# Altium project FPV0-3.PrjPCB
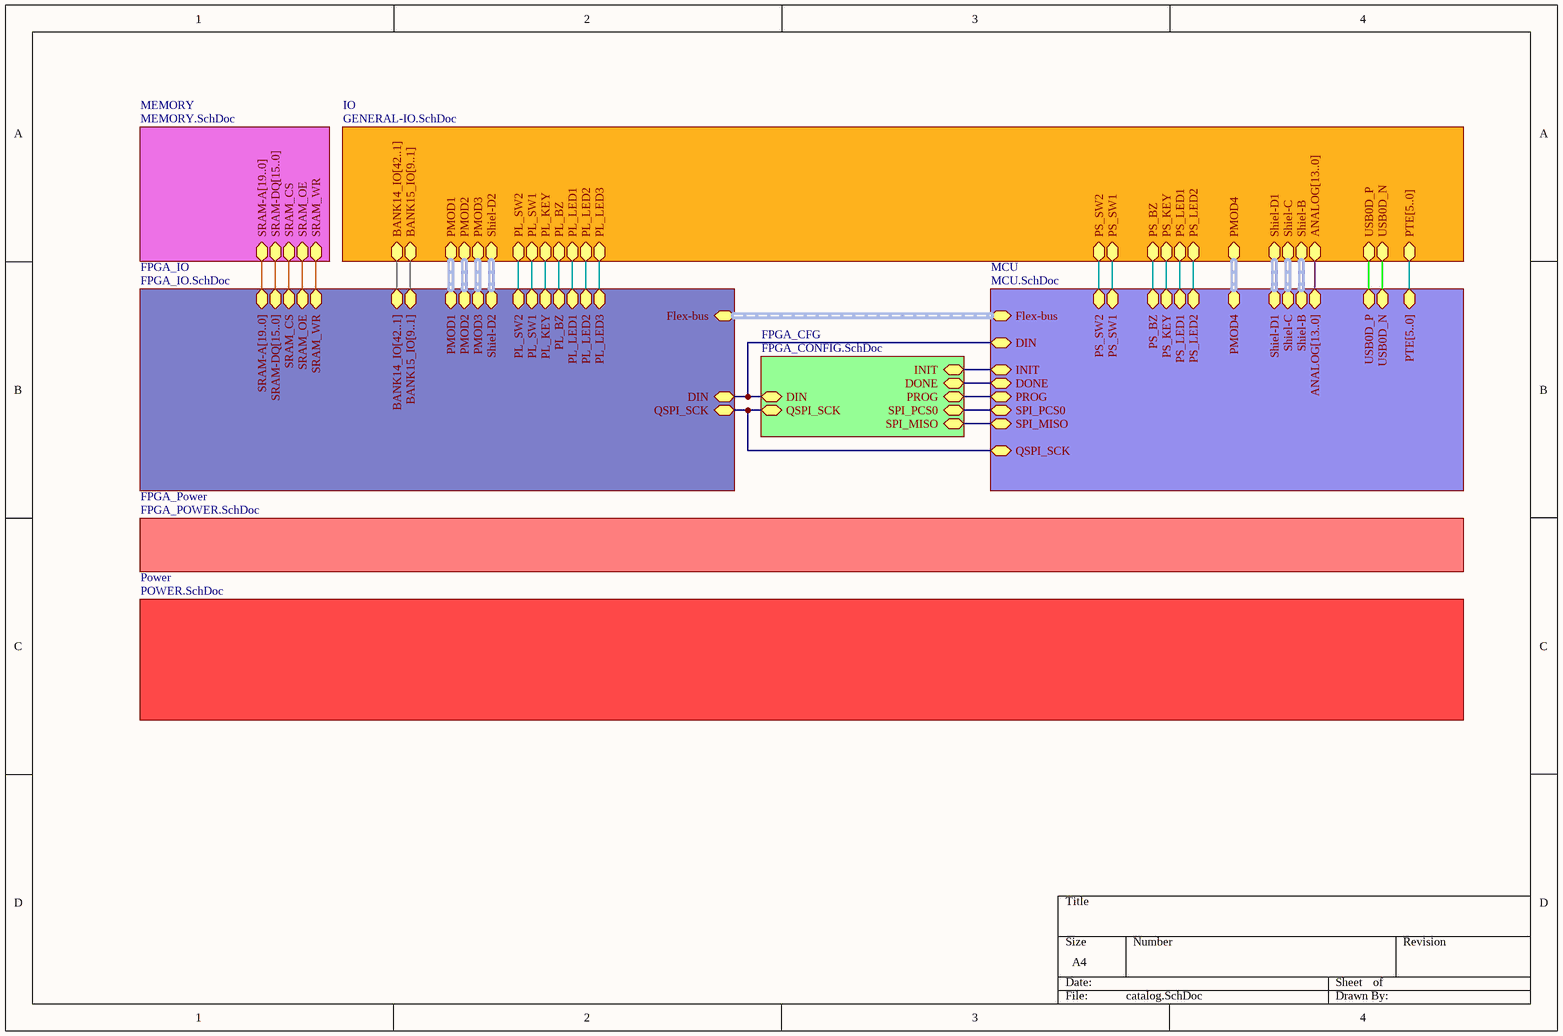
[diagram p0: catalog.SchDoc]
7 sheets, 160 parts. Net scope: hierarchical (ports join the sheet entries above them; power ports are global).
Board file: FPV0-3.PcbDoc
Sheets:
  catalog.SchDoc
    FPGA_IO = FPGA_IO.SchDoc
    Power = POWER.SchDoc
    IO = GENERAL-IO.SchDoc
    MEMORY = MEMORY.SchDoc
    FPGA_CFG = FPGA_CONFIG.SchDoc
    FPGA_Power = FPGA_POWER.SchDoc

## Sheet catalog.SchDoc
size A4

### Sub-sheets
FPGA_CFG = FPGA_CONFIG.SchDoc: QSPI_SCK, DIN, INIT, DONE, PROG, SPI_PCS0, SPI_MISO
FPGA_IO = FPGA_IO.SchDoc: QSPI_SCK, BANK14_IO[42..1], BANK15_IO[9..1], DIN, Flex-bus (harness Flexbus), SRAM-A[19..0] (harness Flexbus), SRAM-DQ[15..0] (harness Flexbus), SRAM_CS, SRAM_OE, SRAM_WR, Shiel-D2 (harness ShielD2), PL_SW2, PL_SW1, PL_KEY, PL_LED1, PL_LED2, PL_LED3, PMOD1 (harness PMOD), PMOD2 (harness PMOD), PMOD3 (harness PMOD), PL_BZ
FPGA_Power = FPGA_POWER.SchDoc: no entries
IO = GENERAL-IO.SchDoc: BANK14_IO[42..1], BANK15_IO[9..1], PTE[5..0] (harness Flexbus), USB0D_P, USB0D_N, ANALOG[13..0], Shiel-B (harness ShielB), PMOD4 (harness PMOD), Shiel-C (harness ShielC), Shiel-D1 (harness ShielD1), Shiel-D2 (harness ShielD2), PS_LED2, PS_LED1, PL_SW2, PL_SW1, PL_KEY, PS_KEY, PS_SW1, PS_SW2, PL_LED1, PL_LED2, PL_LED3, PMOD1 (harness PMOD), PMOD2 (harness PMOD), PMOD3 (harness PMOD), PL_BZ, PS_BZ
MCU = MCU.SchDoc (file not in this document): Flex-bus (harness Flexbus), PTE[5..0] (harness Flexbus), USB0D_N, USB0D_P, ANALOG[13..0], Shiel-B (harness ShielB), PMOD4 (harness PMOD), Shiel-C (harness ShielC), Shiel-D1 (harness ShielD1), DIN, INIT, DONE, PROG, SPI_PCS0, SPI_MISO, QSPI_SCK, PS_LED2, PS_LED1, PS_KEY, PS_SW1, PS_SW2, PS_BZ
MEMORY = MEMORY.SchDoc: SRAM-A[19..0] (harness Flexbus), SRAM-DQ[15..0] (harness Flexbus), SRAM_CS, SRAM_OE, SRAM_WR
Power = POWER.SchDoc: no entries

### Nets
BANK14_IO1: sheet FPGA_IO/PL_KEY, sheet IO/PL_KEY
BANK14_IO2: sheet FPGA_IO/PL_LED3, sheet IO/PL_LED3
BANK14_IO4: sheet FPGA_IO/PL_LED1, sheet IO/PL_LED1
BANK14_IO5: sheet FPGA_IO/PL_LED2, sheet IO/PL_LED2
BANK14_IO6: sheet FPGA_IO/PL_BZ, sheet IO/PL_BZ
BANK34_IO13: sheet FPGA_IO/PL_SW1, sheet IO/PL_SW1
BANK34_IO20: sheet FPGA_IO/PL_SW2, sheet IO/PL_SW2
DIN: sheet FPGA_IO/DIN, sheet FPGA_CFG/DIN, sheet MCU/DIN
DONE: sheet FPGA_CFG/DONE, sheet MCU/DONE
INIT: sheet FPGA_CFG/INIT, sheet MCU/INIT
PROG: sheet FPGA_CFG/PROG, sheet MCU/PROG
PTA6: sheet IO/PS_SW1, sheet MCU/PS_SW1
PTA7: sheet IO/PS_SW2, sheet MCU/PS_SW2
PTD8: sheet IO/PS_LED1, sheet MCU/PS_LED1
PTD9: sheet IO/PS_LED2, sheet MCU/PS_LED2
PTE26: sheet IO/PS_BZ, sheet MCU/PS_BZ
PTE27: sheet IO/PS_KEY, sheet MCU/PS_KEY
QSPI_SCK: sheet FPGA_IO/QSPI_SCK, sheet FPGA_CFG/QSPI_SCK, sheet MCU/QSPI_SCK
SPI2_PCS0: sheet FPGA_CFG/SPI_PCS0, sheet MCU/SPI_PCS0
SPI2_SIN: sheet FPGA_CFG/SPI_MISO, sheet MCU/SPI_MISO
SRAM_CS: sheet FPGA_IO/SRAM_CS, sheet MEMORY/SRAM_CS
SRAM_OE: sheet FPGA_IO/SRAM_OE, sheet MEMORY/SRAM_OE
SRAM_WR: sheet FPGA_IO/SRAM_WR, sheet MEMORY/SRAM_WR
USB0D_N: sheet IO/USB0D_N, sheet MCU/USB0D_N
USB0D_P: sheet IO/USB0D_P, sheet MCU/USB0D_P

### Buses and harness runs
bus sheet FPGA_IO/BANK14_IO[42..1] = sheet IO/BANK14_IO[42..1]
bus sheet FPGA_IO/BANK15_IO[9..1] = sheet IO/BANK15_IO[9..1]
bus sheet IO/ANALOG[13..0] = sheet MCU/ANALOG[13..0]
harness sheet FPGA_IO/Flex-bus = sheet MCU/Flex-bus
harness sheet FPGA_IO/PMOD1 = sheet IO/PMOD1
harness sheet FPGA_IO/PMOD2 = sheet IO/PMOD2
harness sheet FPGA_IO/PMOD3 = sheet IO/PMOD3
harness sheet FPGA_IO/Shiel-D2 = sheet IO/Shiel-D2
harness sheet IO/PMOD4 = sheet MCU/PMOD4
harness sheet IO/Shiel-B = sheet MCU/Shiel-B
harness sheet IO/Shiel-C = sheet MCU/Shiel-C
harness sheet IO/Shiel-D1 = sheet MCU/Shiel-D1

## Sheet FPGA_IO.SchDoc
size A3
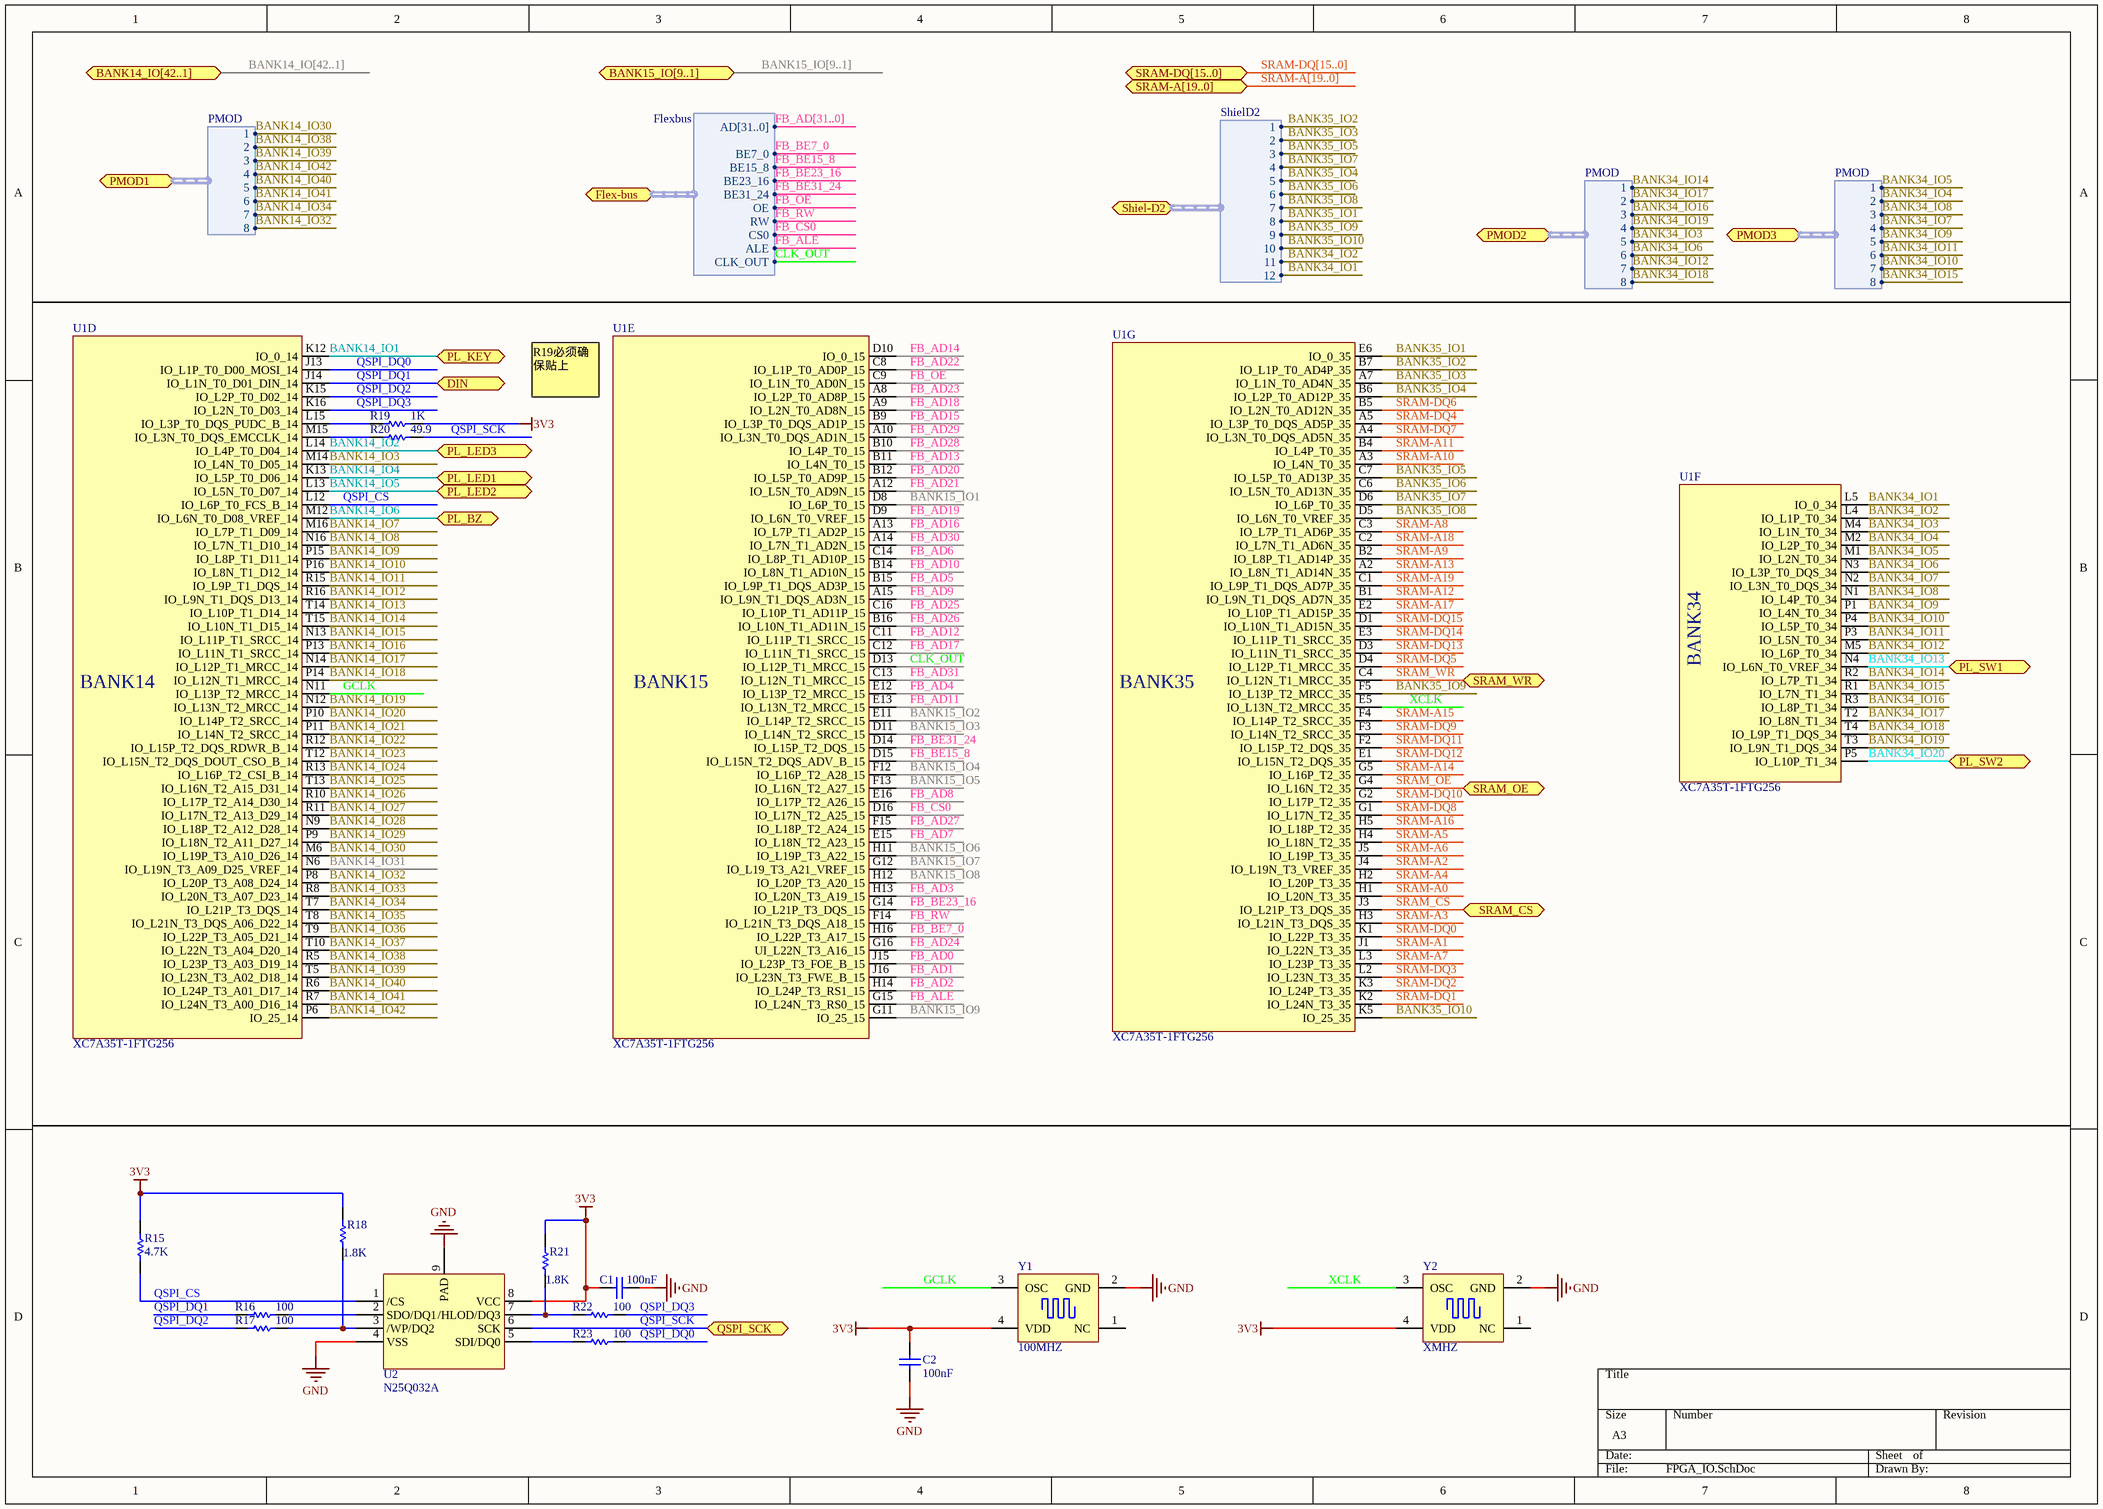
[diagram p1: FPGA_IO.SchDoc]

### Parts
C1  value 100nF  [1608[0603]]  (hidden comment: Cap)
C2  value 100nF  [1608[0603]]  (hidden comment: Cap)
R15  value 4.7K  [1608[0603]]  (hidden comment: Res)
R16  value 100  [1608[0603]]  (hidden comment: Res)
R17  value 100  [1608[0603]]  (hidden comment: Res)
R18  value 1.8K  [1608[0603]]  (hidden comment: Res)
R19  value 1K  [1608[0603]]  (hidden comment: Res)
R20  value 49.9  [R2012]  (hidden comment: Res)
R21  value 1.8K  [1608[0603]]  (hidden comment: Res)
R22  value 100  [1608[0603]]  (hidden comment: Res)
R23  value 100  [R2012]  (hidden comment: Res)
U1  XC7A35T-1FTG256  [BGA100P9X9-81A]  (parts D,E,F,G of 7)
U2  N25Q032A  [QFN127P500X600X100_HS-9N]
Y1  100MHZ  [XTAL7_3225]
Y2  XMHZ  [XTAL7_3225]

### Ports
BANK14_IO[42..1], BANK15_IO[9..1], DIN, Flex-bus (harness Flexbus), PL_BZ, PL_KEY, PL_LED1, PL_LED2, PL_LED3, PL_SW1, PL_SW2, PMOD1 (harness PMOD), PMOD2 (harness PMOD), PMOD3 (harness PMOD), QSPI_SCK, Shiel-D2 (harness ShielD2), SRAM-A[19..0], SRAM-DQ[15..0], SRAM_CS, SRAM_OE, SRAM_WR

### Harnesses
Flexbus: BE7_0, CS0, BE31_24, CLK_OUT, ALE, BE23_16, RW, BE15_8, OE, AD[31..0]
ShielD2: 1, 2, 3, 4, 5, 6, 7, 8, 9, 10, 11, 12
PMOD: 1, 2, 3, 4, 5, 6, 7, 8

### Nets
3V3: C1.1 C2.2 R15.1 R18.1 R19.1 R21.1 U2.8(VCC) Y1.4(VDD) Y2.4(VDD)
GND: C1.2 C2.1 U2.4(VSS) U2.9(PAD) Y1.2(GND) Y2.2(GND)
BANK14_IO1: U1.K12(IO_0_14) ; port PL_KEY
BANK14_IO2: U1.L14(IO_L4P_T0_D04_14) ; port PL_LED3
BANK14_IO3: U1.M14(IO_L4N_T0_D05_14)
BANK14_IO4: U1.K13(IO_L5P_T0_D06_14) ; port PL_LED1
BANK14_IO5: U1.L13(IO_L5N_T0_D07_14) ; port PL_LED2
BANK14_IO6: U1.M12(IO_L6N_T0_D08_VREF_14) ; port PL_BZ
BANK14_IO7: U1.M16(IO_L7P_T1_D09_14)
BANK14_IO8: U1.N16(IO_L7N_T1_D10_14)
BANK14_IO9: U1.P15(IO_L8P_T1_D11_14)
BANK14_IO10: U1.P16(IO_L8N_T1_D12_14)
BANK14_IO11: U1.R15(IO_L9P_T1_DQS_14)
BANK14_IO12: U1.R16(IO_L9N_T1_DQS_D13_14)
BANK14_IO13: U1.T14(IO_L10P_T1_D14_14)
BANK14_IO14: U1.T15(IO_L10N_T1_D15_14)
BANK14_IO15: U1.N13(IO_L11P_T1_SRCC_14)
BANK14_IO16: U1.P13(IO_L11N_T1_SRCC_14)
BANK14_IO17: U1.N14(IO_L12P_T1_MRCC_14)
BANK14_IO18: U1.P14(IO_L12N_T1_MRCC_14)
BANK14_IO19: U1.N12(IO_L13N_T2_MRCC_14)
BANK14_IO20: U1.P10(IO_L14P_T2_SRCC_14)
BANK14_IO21: U1.P11(IO_L14N_T2_SRCC_14)
BANK14_IO22: U1.R12(IO_L15P_T2_DQS_RDWR_B_14)
BANK14_IO23: U1.T12(IO_L15N_T2_DQS_DOUT_CSO_B_14)
BANK14_IO24: U1.R13(IO_L16P_T2_CSI_B_14)
BANK14_IO25: U1.T13(IO_L16N_T2_A15_D31_14)
BANK14_IO26: U1.R10(IO_L17P_T2_A14_D30_14)
BANK14_IO27: U1.R11(IO_L17N_T2_A13_D29_14)
BANK14_IO28: U1.N9(IO_L18P_T2_A12_D28_14)
BANK14_IO29: U1.P9(IO_L18N_T2_A11_D27_14)
BANK14_IO30: U1.M6(IO_L19P_T3_A10_D26_14) ; port PMOD1.1
BANK14_IO31: U1.N6(IO_L19N_T3_A09_D25_VREF_14)
BANK14_IO32: U1.P8(IO_L20P_T3_A08_D24_14) ; port PMOD1.8
BANK14_IO33: U1.R8(IO_L20N_T3_A07_D23_14)
BANK14_IO34: U1.T7(IO_L21P_T3_DQS_14) ; port PMOD1.7
BANK14_IO35: U1.T8(IO_L21N_T3_DQS_A06_D22_14)
BANK14_IO36: U1.T9(IO_L22P_T3_A05_D21_14)
BANK14_IO37: U1.T10(IO_L22N_T3_A04_D20_14)
BANK14_IO38: U1.R5(IO_L23P_T3_A03_D19_14) ; port PMOD1.2
BANK14_IO39: U1.T5(IO_L23N_T3_A02_D18_14) ; port PMOD1.3
BANK14_IO40: U1.R6(IO_L24P_T3_A01_D17_14) ; port PMOD1.5
BANK14_IO41: U1.R7(IO_L24N_T3_A00_D16_14) ; port PMOD1.6
BANK14_IO42: U1.P6(IO_25_14) ; port PMOD1.4
BANK15_IO1: U1.D8(IO_L6P_T0_15)
BANK15_IO2: U1.E11(IO_L14P_T2_SRCC_15)
BANK15_IO3: U1.D11(IO_L14N_T2_SRCC_15)
BANK15_IO4: U1.F12(IO_L16P_T2_A28_15)
BANK15_IO5: U1.F13(IO_L16N_T2_A27_15)
BANK15_IO6: U1.H11(IO_L19P_T3_A22_15)
BANK15_IO7: U1.G12(IO_L19_T3_A21_VREF_15)
BANK15_IO8: U1.H12(IO_L20P_T3_A20_15)
BANK15_IO9: U1.G11(IO_25_15)
BANK34_IO1: U1.L5(IO_0_34) ; port Shiel-D2.12
BANK34_IO2: U1.L4(IO_L1P_T0_34) ; port Shiel-D2.11
BANK34_IO3: U1.M4(IO_L1N_T0_34) ; port PMOD2.5
BANK34_IO4: U1.M2(IO_L2P_T0_34) ; port PMOD3.2
BANK34_IO5: U1.M1(IO_L2N_T0_34) ; port PMOD3.1
BANK34_IO6: U1.N3(IO_L3P_T0_DQS_34) ; port PMOD2.6
BANK34_IO7: U1.N2(IO_L3N_T0_DQS_34) ; port PMOD3.4
BANK34_IO8: U1.N1(IO_L4P_T0_34) ; port PMOD3.3
BANK34_IO9: U1.P1(IO_L4N_T0_34) ; port PMOD3.5
BANK34_IO10: U1.P4(IO_L5P_T0_34) ; port PMOD3.7
BANK34_IO11: U1.P3(IO_L5N_T0_34) ; port PMOD3.6
BANK34_IO12: U1.M5(IO_L6P_T0_34) ; port PMOD2.7
BANK34_IO13: U1.N4(IO_L6N_T0_VREF_34) ; port PL_SW1
BANK34_IO14: U1.R2(IO_L7P_T1_34) ; port PMOD2.1
BANK34_IO15: U1.R1(IO_L7N_T1_34) ; port PMOD3.8
BANK34_IO16: U1.R3(IO_L8P_T1_34) ; port PMOD2.3
BANK34_IO17: U1.T2(IO_L8N_T1_34) ; port PMOD2.2
BANK34_IO18: U1.T4(IO_L9P_T1_DQS_34) ; port PMOD2.8
BANK34_IO19: U1.T3(IO_L9N_T1_DQS_34) ; port PMOD2.4
BANK34_IO20: U1.P5(IO_L10P_T1_34) ; port PL_SW2
BANK35_IO1: U1.E6(IO_0_35) ; port Shiel-D2.8
BANK35_IO2: U1.B7(IO_L1P_T0_AD4P_35) ; port Shiel-D2.1
BANK35_IO3: U1.A7(IO_L1N_T0_AD4N_35) ; port Shiel-D2.2
BANK35_IO4: U1.B6(IO_L2P_T0_AD12P_35) ; port Shiel-D2.5
BANK35_IO5: U1.C7(IO_L5P_T0_AD13P_35) ; port Shiel-D2.3
BANK35_IO6: U1.C6(IO_L5N_T0_AD13N_35) ; port Shiel-D2.6
BANK35_IO7: U1.D6(IO_L6P_T0_35) ; port Shiel-D2.4
BANK35_IO8: U1.D5(IO_L6N_T0_VREF_35) ; port Shiel-D2.7
BANK35_IO9: U1.F5(IO_L13P_T2_MRCC_35) ; port Shiel-D2.9
BANK35_IO10: U1.K5(IO_25_35) ; port Shiel-D2.10
CLK_OUT: U1.D13(IO_L12P_T1_MRCC_15) ; port Flex-bus.CLK_OUT
FB_AD0: U1.J15(IO_L23P_T3_FOE_B_15)
FB_AD1: U1.J16(IO_L23N_T3_FWE_B_15)
FB_AD2: U1.H14(IO_L24P_T3_RS1_15)
FB_AD3: U1.H13(IO_L20N_T3_A19_15)
FB_AD4: U1.E12(IO_L13P_T2_MRCC_15)
FB_AD5: U1.B15(IO_L9P_T1_DQS_AD3P_15)
FB_AD6: U1.C14(IO_L8P_T1_AD10P_15)
FB_AD7: U1.E15(IO_L18N_T2_A23_15)
FB_AD8: U1.E16(IO_L17P_T2_A26_15)
FB_AD9: U1.A15(IO_L9N_T1_DQS_AD3N_15)
FB_AD10: U1.B14(IO_L8N_T1_AD10N_15)
FB_AD11: U1.E13(IO_L13N_T2_MRCC_15)
FB_AD12: U1.C11(IO_L11P_T1_SRCC_15)
FB_AD13: U1.B11(IO_L4N_T0_15)
FB_AD14: U1.D10(IO_0_15)
FB_AD15: U1.B9(IO_L3P_T0_DQS_AD1P_15)
FB_AD16: U1.A13(IO_L7P_T1_AD2P_15)
FB_AD17: U1.C12(IO_L11N_T1_SRCC_15)
FB_AD18: U1.A9(IO_L2N_T0_AD8N_15)
FB_AD19: U1.D9(IO_L6N_T0_VREF_15)
FB_AD20: U1.B12(IO_L5P_T0_AD9P_15)
FB_AD21: U1.A12(IO_L5N_T0_AD9N_15)
FB_AD22: U1.C8(IO_L1P_T0_AD0P_15)
FB_AD23: U1.A8(IO_L2P_T0_AD8P_15)
FB_AD24: U1.G16(UI_L22N_T3_A16_15)
FB_AD25: U1.C16(IO_L10P_T1_AD11P_15)
FB_AD26: U1.B16(IO_L10N_T1_AD11N_15)
FB_AD27: U1.F15(IO_L18P_T2_A24_15)
FB_AD28: U1.B10(IO_L4P_T0_15)
FB_AD29: U1.A10(IO_L3N_T0_DQS_AD1N_15)
FB_AD30: U1.A14(IO_L7N_T1_AD2N_15)
FB_AD31: U1.C13(IO_L12N_T1_MRCC_15)
FB_ALE: U1.G15(IO_L24N_T3_RS0_15) ; port Flex-bus.ALE
FB_BE7_0: U1.H16(IO_L22P_T3_A17_15) ; port Flex-bus.BE7_0
FB_BE15_8: U1.D15(IO_L15N_T2_DQS_ADV_B_15) ; port Flex-bus.BE15_8
FB_BE23_16: U1.G14(IO_L21P_T3_DQS_15) ; port Flex-bus.BE23_16
FB_BE31_24: U1.D14(IO_L15P_T2_DQS_15) ; port Flex-bus.BE31_24
FB_CS0: U1.D16(IO_L17N_T2_A25_15) ; port Flex-bus.CS0
FB_OE: U1.C9(IO_L1N_T0_AD0N_15) ; port Flex-bus.OE
FB_RW: U1.F14(IO_L21N_T3_DQS_A18_15) ; port Flex-bus.RW
GCLK: U1.N11(IO_L13P_T2_MRCC_14) Y1.3(OSC)
QSPI_CS: R15.2 U1.L12(IO_L6P_T0_FCS_B_14) U2.1(/CS)
QSPI_DQ0: R23.1 U1.J13(IO_L1P_T0_D00_MOSI_14)
QSPI_DQ1: R16.2 U1.J14(IO_L1N_T0_D01_DIN_14) ; port DIN  [project net DIN]
QSPI_DQ2: R17.2 U1.K15(IO_L2P_T0_D02_14)
QSPI_DQ3: R22.1 U1.K16(IO_L2N_T0_D03_14)
QSPI_SCK: R20.1 U2.6(SCK) ; port QSPI_SCK
SRAM-A0: U1.H1(IO_L20N_T3_35)
SRAM-A1: U1.J1(IO_L22N_T3_35)
SRAM-A2: U1.J4(IO_L19N_T3_VREF_35)
SRAM-A3: U1.H3(IO_L21N_T3_DQS_35)
SRAM-A4: U1.H2(IO_L20P_T3_35)
SRAM-A5: U1.H4(IO_L18N_T2_35)
SRAM-A6: U1.J5(IO_L19P_T3_35)
SRAM-A7: U1.L3(IO_L23P_T3_35)
SRAM-A8: U1.C3(IO_L7P_T1_AD6P_35)
SRAM-A9: U1.B2(IO_L8P_T1_AD14P_35)
SRAM-A10: U1.A3(IO_L4N_T0_35)
SRAM-A11: U1.B4(IO_L4P_T0_35)
SRAM-A12: U1.B1(IO_L9N_T1_DQS_AD7N_35)
SRAM-A13: U1.A2(IO_L8N_T1_AD14N_35)
SRAM-A14: U1.G5(IO_L16P_T2_35)
SRAM-A15: U1.F4(IO_L14P_T2_SRCC_35)
SRAM-A16: U1.H5(IO_L18P_T2_35)
SRAM-A17: U1.E2(IO_L10P_T1_AD15P_35)
SRAM-A18: U1.C2(IO_L7N_T1_AD6N_35)
SRAM-A19: U1.C1(IO_L9P_T1_DQS_AD7P_35)
SRAM-DQ0: U1.K1(IO_L22P_T3_35)
SRAM-DQ1: U1.K2(IO_L24N_T3_35)
SRAM-DQ2: U1.K3(IO_L24P_T3_35)
SRAM-DQ3: U1.L2(IO_L23N_T3_35)
SRAM-DQ4: U1.A5(IO_L3P_T0_DQS_AD5P_35)
SRAM-DQ5: U1.D4(IO_L12P_T1_MRCC_35)
SRAM-DQ6: U1.B5(IO_L2N_T0_AD12N_35)
SRAM-DQ7: U1.A4(IO_L3N_T0_DQS_AD5N_35)
SRAM-DQ8: U1.G1(IO_L17N_T2_35)
SRAM-DQ9: U1.F3(IO_L14N_T2_SRCC_35)
SRAM-DQ10: U1.G2(IO_L17P_T2_35)
SRAM-DQ11: U1.F2(IO_L15P_T2_DQS_35)
SRAM-DQ12: U1.E1(IO_L15N_T2_DQS_35)
SRAM-DQ13: U1.D3(IO_L11N_T1_SRCC_35)
SRAM-DQ14: U1.E3(IO_L11P_T1_SRCC_35)
SRAM-DQ15: U1.D1(IO_L10N_T1_AD15N_35)
SRAM_CS: U1.J3(IO_L21P_T3_DQS_35) ; port SRAM_CS
SRAM_OE: U1.G4(IO_L16N_T2_35) ; port SRAM_OE
SRAM_WR: U1.C4(IO_L12N_T1_MRCC_35) ; port SRAM_WR
XCLK: U1.E5(IO_L13N_T2_MRCC_35) Y2.3(OSC)
NetR16_1: R16.1 U2.2(SDO/DQ1)
NetR17_1: R17.1 R18.2 U2.3(/WP/DQ2)
NetR19_2: R19.2 U1.L15(IO_L3P_T0_DQS_PUDC_B_14)
NetR20_2: R20.2 U1.M15(IO_L3N_T0_DQS_EMCCLK_14)
NetR21_2: R21.2 R22.2 U2.7(/HLOD/DQ3)
NetR23_2: R23.2 U2.5(SDI/DQ0)

Not connected (* = marked no-connect by the designer): Y1 1(NC); Y2 1(NC)

### Buses and harness runs
bus BANK14_IO[42..1] = port BANK14_IO[42..1]
bus BANK15_IO[9..1] = port BANK15_IO[9..1]
bus FB_AD[31..0]
bus SRAM-A[19..0] = port SRAM-A[19..0]
bus SRAM-DQ[15..0] = port SRAM-DQ[15..0]

### Notes on the sheet
- R19必须确保贴上
- (in symbol XC7A35T-1FTG256, part D) BANK14
- (in symbol XC7A35T-1FTG256, part E) BANK15
- (in symbol XC7A35T-1FTG256, part F) BANK34
- (in symbol XC7A35T-1FTG256, part G) BANK35

### Library data of the parts
C1 C2 = Cap: 贴片电容; Published: 8-Jun-2000; LatestRevisionDate: 17-Jul-2002; LatestRevisionNote: Re-released for DXP Platform.; PackageReference: RAD-0.3; Publisher: Altium Limited
R15-R23 = Res: 贴片电阻; Published: 8-Jun-2000; LatestRevisionDate: 17-Jul-2002; LatestRevisionNote: Re-released for DXP Platform.; PackageReference: AXIAL-0.3; Publisher: Altium Limited
Y1 Y2 = XTAL1

## Sheet POWER.SchDoc
size A4
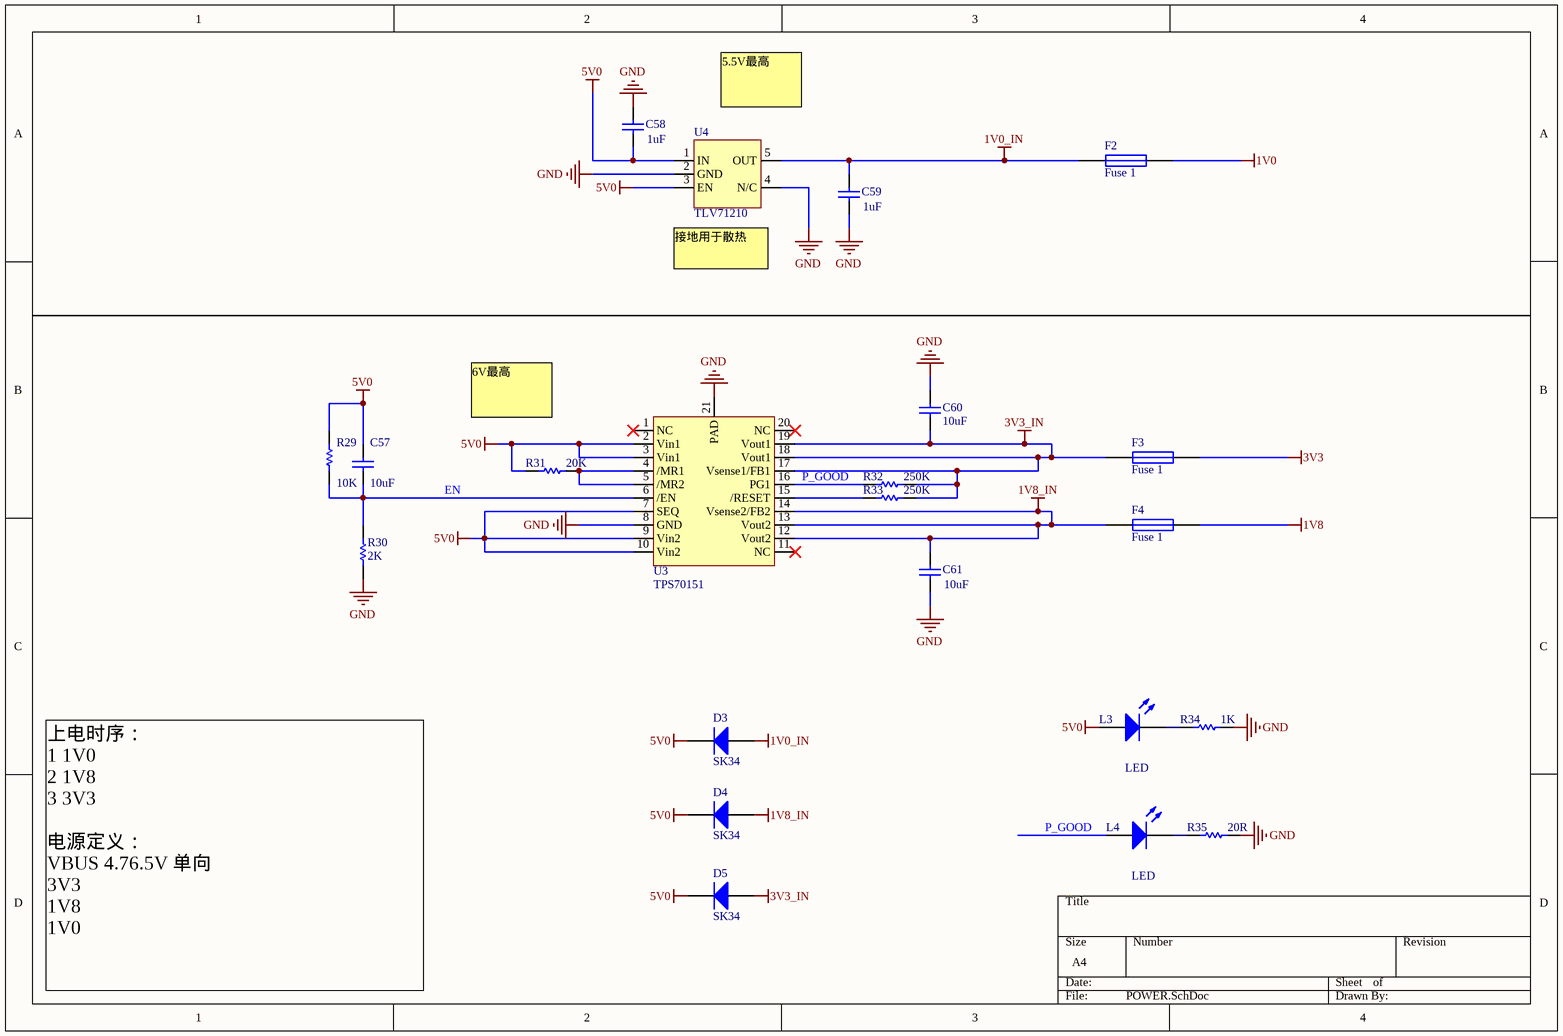
[diagram p2: POWER.SchDoc]

### Parts
C57  value 10uF  [1608[0603]]  (hidden comment: Cap)
C58  value 1uF  [1608[0603]]  (hidden comment: Cap)
C59  value 1uF  [1608[0603]]  (hidden comment: Cap)
C60  value 10uF  [1608[0603]]  (hidden comment: Cap)
C61  value 10uF  [1608[0603]]  (hidden comment: Cap)
D3  SK34  [1206]
D4  SK34  [1206]
D5  SK34  [1206]
F2  Fuse 1  [1206]
F3  Fuse 1  [1206]
F4  Fuse 1  [1206]
L3  LED  [1608[0603]]
L4  LED  [1608[0603]]
R29  value 10K  [1608[0603]]  (hidden comment: Res)
R30  value 2K  [1608[0603]]  (hidden comment: Res)
R31  value 20K  [1608[0603]]  (hidden comment: Res)
R32  value 250K  [1608[0603]]  (hidden comment: Res)
R33  value 250K  [1608[0603]]  (hidden comment: Res)
R34  value 1K  [1608[0603]]  (hidden comment: Res)
R35  value 20R  [1608[0603]]  (hidden comment: Res)
U3  TPS70151  [TPS701]
U4  TLV71210  [TLV712]

### Nets
1V0: F2.1
1V0_IN: C59.1 D3.1(A) F2.2 U4.5(OUT)
1V8: F4.1
1V8_IN: C61.1 D4.1(A) F4.2 U3.12(Vout2) U3.13(Vout2) U3.14(Vsense2/FB2)
3V3: F3.1
3V3_IN: C60.1 D5.1(A) F3.2 R32.1 R33.1 U3.17(Vsense1/FB1) U3.18(Vout1) U3.19(Vout1)
5V0: C57.1 C58.2 D3.2(K) D4.2(K) D5.2(K) L3.1(A) R29.1 R31.2 U3.2(Vin1) U3.3(Vin1) U3.7(SEQ) U3.9(Vin2) U3.10(Vin2) U4.1(IN) U4.3(EN)
GND: C58.1 C59.2 C60.2 C61.2 R30.2 R34.1 R35.1 U3.8(GND) U3.21(PAD) U4.2(GND) U4.4(N/C)
EN: C57.2 R29.2 R30.1 U3.6(/EN)
P_GOOD: L4.1(A) R32.2 U3.16(PG1)
NetL3_2: L3.2(K) R34.2
NetL4_2: L4.2(K) R35.2
NetR31_1: R31.1 U3.4(/MR1) U3.5(/MR2)
NetR33_2: R33.2 U3.15(/RESET)

Not connected (* = marked no-connect by the designer): U3 1(NC)* 11(NC)* 20(NC)*

### Notes on the sheet
- 5.5V最高
- (near U4) 接地用于散热
- 6V最高
- 上电时序：
  1 1V0
  2 1V8
  3 3V3
  电源定义：
  VBUS 4.76.5V 单向
  3V3
  1V8
  1V0

### Library data of the parts
C57-C61 = Cap: 贴片电容; Published: 8-Jun-2000; LatestRevisionDate: 17-Jul-2002; LatestRevisionNote: Re-released for DXP Platform.; PackageReference: RAD-0.3; Publisher: Altium Limited
D3-D5 = Diode 1N4148: High Conductance Fast Diode; LatestRevisionDate: 17-Jul-2002; LatestRevisionNote: Re-released for DXP Platform.; DatasheetDocument: 1997; PackageReference: DO-35; Publisher: Altium Limited; Code_JEDEC: DO-204-AH; ComponentLink1Description: Manufacturer Link; ComponentLink2Description: Datasheet; ComponentLink2URL: http://www.fairchildsemi.com/ds/1N%2F1N4148.pdf
F2-F4 = Fuse 1: Fuse; Published: 8-Jun-2000; LatestRevisionDate: 17-Jul-2002; LatestRevisionNote: Re-released for DXP Platform.; PackageReference: PIN-W2/E2.8; Publisher: Altium Limited; PackageDescription: Thru-Hole; 2 Leads
R29-R35 = Res: 贴片电阻; Published: 8-Jun-2000; LatestRevisionDate: 17-Jul-2002; LatestRevisionNote: Re-released for DXP Platform.; PackageReference: AXIAL-0.3; Publisher: Altium Limited
U3 = TPS701
U4 = TLV712

## Sheet GENERAL-IO.SchDoc
size A3
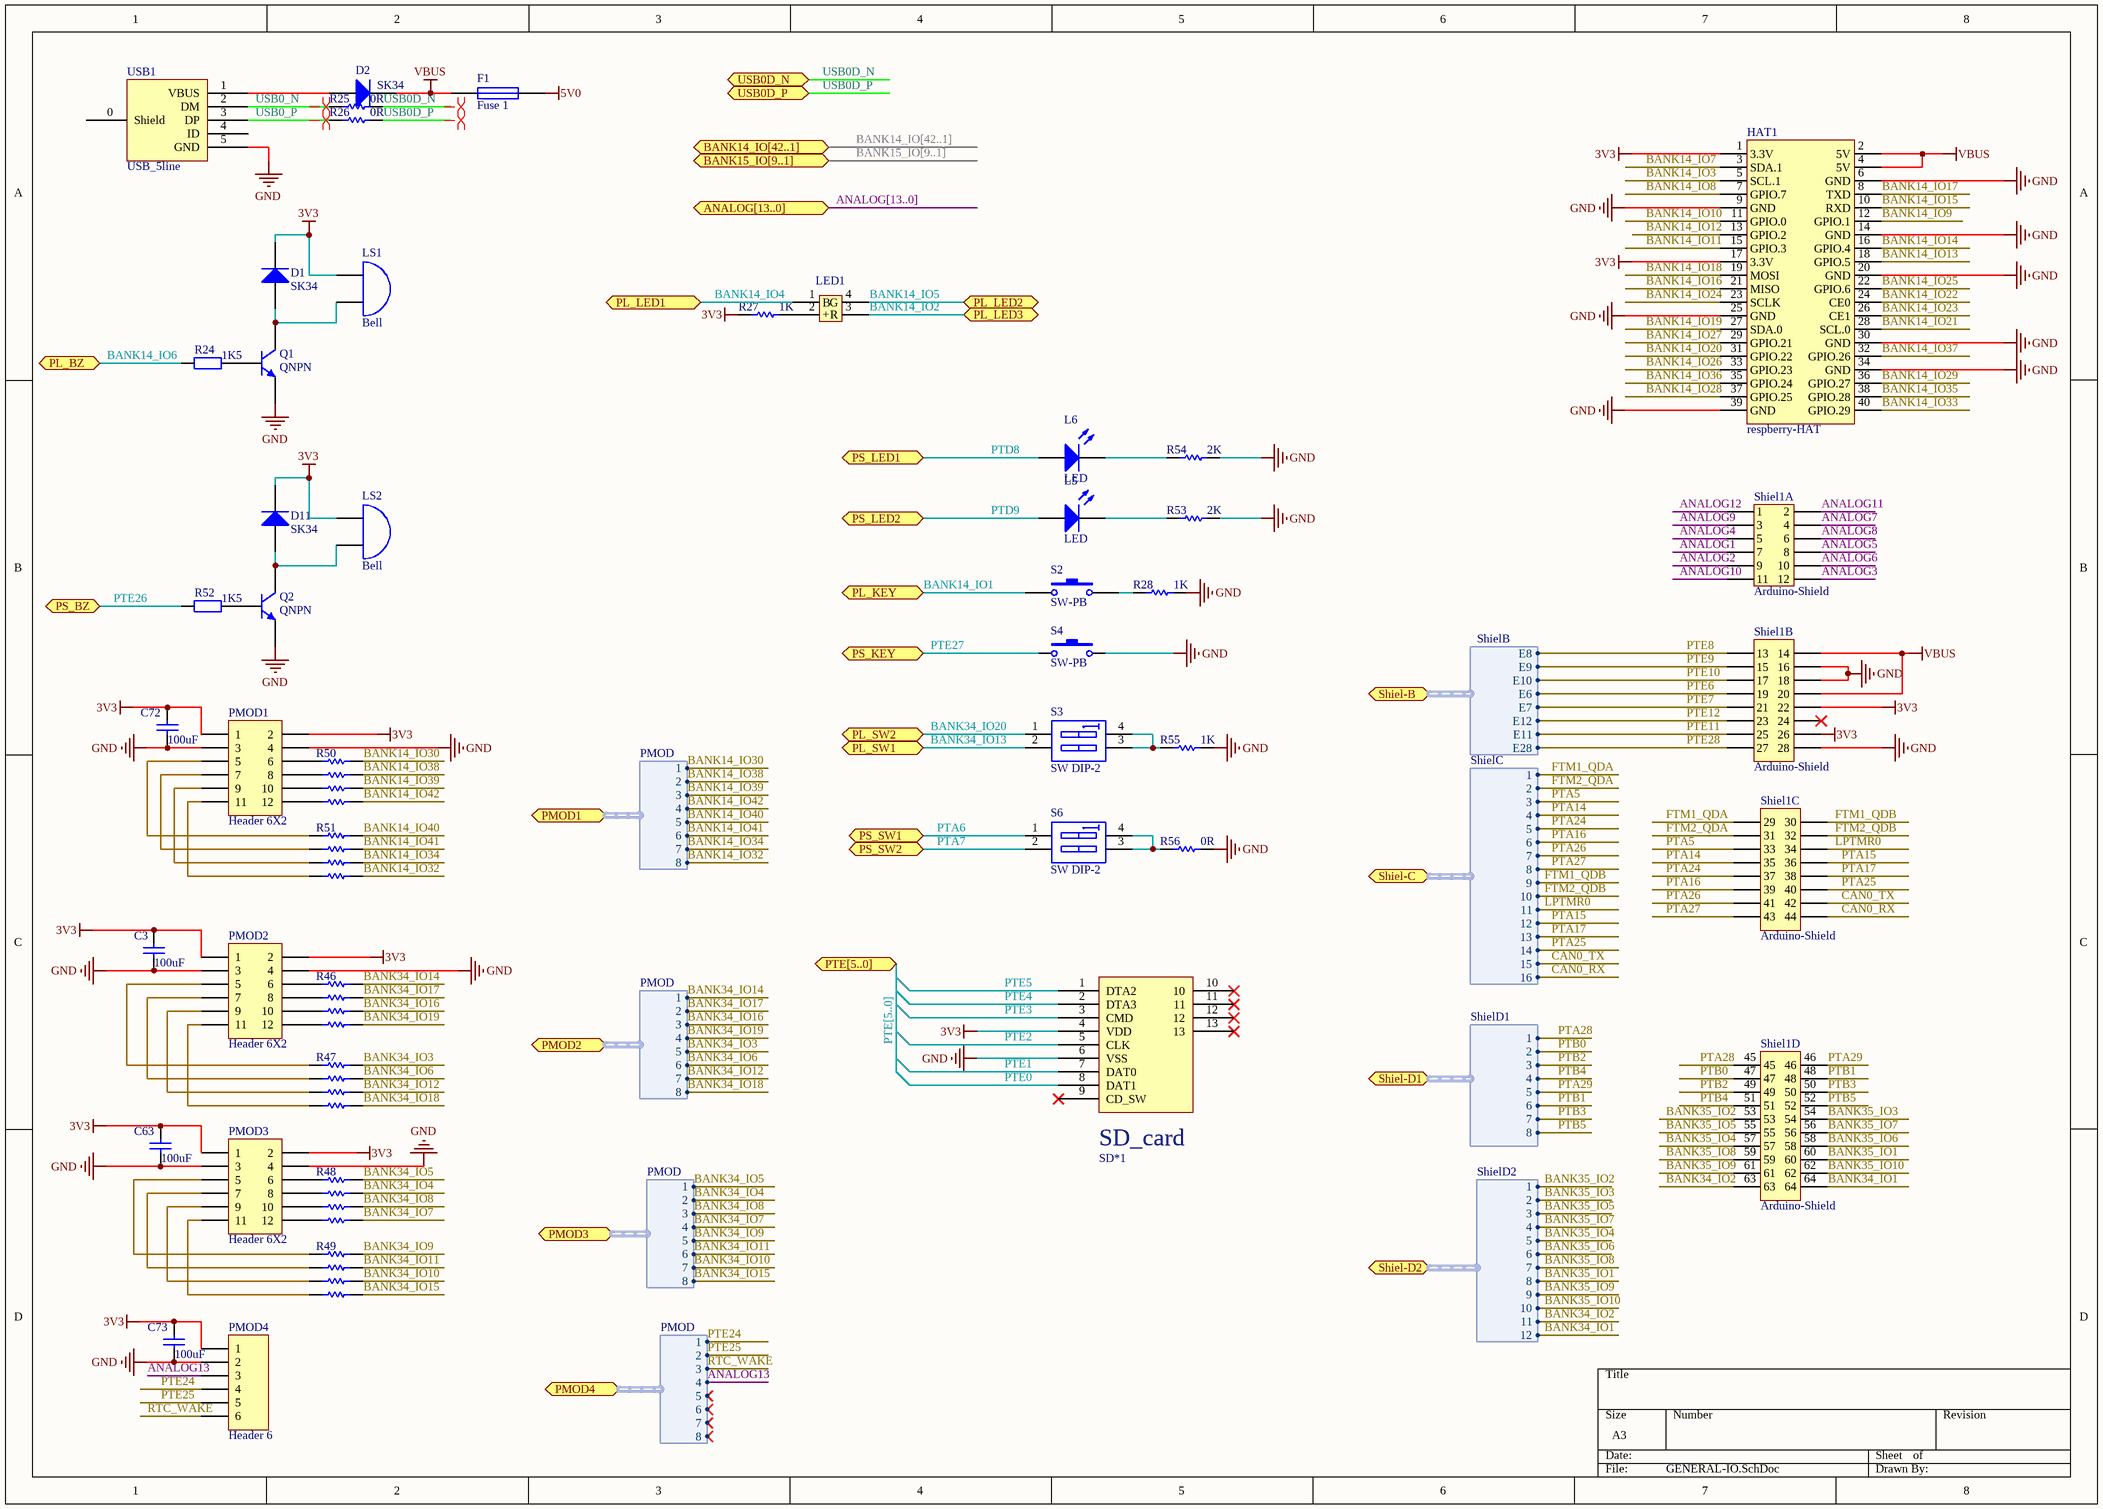
[diagram p3: GENERAL-IO.SchDoc]

### Parts
C3  value 100uF  [1206]  (hidden comment: Cap)
C63  value 100uF  [1206]  (hidden comment: Cap)
C72  value 100uF  [1206]  (hidden comment: Cap)
C73  value 100uF  [1206]  (hidden comment: Cap)
D1  SK34  [1206]
D2  SK34  [1206]
D11  SK34  [1206]
F1  Fuse 1  [1206]
HAT1  respberry-HAT  [SMT-HAT]
L5  LED  [1608[0603]]
L6  LED  [1608[0603]]
LED1  RGB_LED1206  [RGB]  (value not drawn)
LS1  Bell  [MLT-5020 BZ]
LS2  Bell  [BZ]
PMOD1  Header 6X2  [HDR2X6]
PMOD2  Header 6X2  [HDR2X6]
PMOD3  Header 6X2  [HDR2X6]
PMOD4  Header 6  [HDR1X6]
Q1  QNPN  [SOT23_N]
Q2  QNPN  [SOT23_N]
R24  value 1K5  [1608[0603]]  (hidden comment: Res2)
R25  value 0R  [1608[0603]]  (hidden comment: Res)
R26  value 0R  [1608[0603]]  (hidden comment: Res)
R27  value 1K  [1608[0603]]  (hidden comment: Res)
R28  value 1K  [1608[0603]]  (hidden comment: Res)
R46  res*4  [0603*4]  (value not drawn)
R47  res*4  [0603*4]  (value not drawn)
R48  res*4  [0603*4]  (value not drawn)
R49  res*4  [0603*4]  (value not drawn)
R50  res*4  [0603*4]  (value not drawn)
R51  res*4  [0603*4]  (value not drawn)
R52  value 1K5  [1608[0603]]  (hidden comment: Res2)
R53  value 2K  [1608[0603]]  (hidden comment: Res)
R54  value 2K  [1608[0603]]  (hidden comment: Res)
R55  value 1K  [1608[0603]]  (hidden comment: Res)
R56  value 0R  [1608[0603]]  (hidden comment: Res)
S2  SW-PB  [key 3*4*2]
S3  SW DIP-2  [sw*2]
S4  SW-PB  [key 3*4*2]
S6  SW DIP-2  [sw*2]
SD*1  TF_card  [TF卡座(短体)]  (value not drawn)
Shiel1  Arduino-Shield  [SMT-B-Shield]  (parts A,B,C,D of 4)
USB1  USB_5line  [USB-MICRO-5P-2F]

### Ports
ANALOG[13..0] (harness Flexbus), BANK14_IO[42..1], BANK15_IO[9..1], PL_BZ, PL_KEY, PL_LED1, PL_LED2, PL_LED3, PL_SW1, PL_SW2, PMOD1 (harness PMOD), PMOD2 (harness PMOD), PMOD3 (harness PMOD), PMOD4 (harness PMOD), PS_BZ, PS_KEY, PS_LED1, PS_LED2, PS_SW1, PS_SW2, PTE[5..0], Shiel-B (harness ShielB), Shiel-C (harness ShielC), Shiel-D1 (harness ShielD1), Shiel-D2 (harness ShielD2), USB0D_N, USB0D_P

### Harnesses
ShielB: E8, E9, E10, E6, E7, E12, E11, E28
PMOD: 1, 2, 3, 4, 5, 6, 7, 8
ShielC: 1, 2, 3, 4, 5, 6, 7, 8, 9, 10, 11, 12, 13, 14, 15, 16
ShielD1: 1, 2, 3, 4, 5, 6, 7, 8
ShielD2: 1, 2, 3, 4, 5, 6, 7, 8, 9, 10, 11, 12

### Nets
3V3: C3.1 C63.1 C72.1 C73.1 D1.2(K) D11.2(K) HAT1.1(3.3V) HAT1.17(3.3V) LS1.1(A) LS2.1(A) PMOD1.1 PMOD1.2 PMOD2.1 PMOD2.2 PMOD3.1 PMOD3.2 PMOD4.1 R27.2 SD*1.4(VDD) Shiel1.22 Shiel1.26
5V0: F1.1
GND: C3.2 C63.2 C72.2 C73.2 HAT1.6(GND) HAT1.9(GND) HAT1.14(GND) HAT1.20(GND) HAT1.25(GND) HAT1.30(GND) HAT1.34(GND) HAT1.39(GND) PMOD1.3 PMOD1.4 PMOD2.3 PMOD2.4 PMOD3.3 PMOD3.4 PMOD4.2 Q1.3(E) Q2.3(E) R28.1 R53.1 R54.1 R55.1 R56.1 S4.2 SD*1.6(VSS) Shiel1.16 Shiel1.18 Shiel1.28 USB1.5(GND)
VBUS: D2.2(K) F1.2 HAT1.2(5V) HAT1.4(5V) Shiel1.14 Shiel1.20
ANALOG1: Shiel1.7
ANALOG2: Shiel1.9
ANALOG3: Shiel1.12
ANALOG4: Shiel1.5
ANALOG5: Shiel1.8
ANALOG6: Shiel1.10
ANALOG7: Shiel1.4
ANALOG8: Shiel1.6
ANALOG9: Shiel1.3
ANALOG10: Shiel1.11
ANALOG11: Shiel1.2
ANALOG12: Shiel1.1
ANALOG13: PMOD4.3 ; port PMOD4.4
BANK14_IO1: S2.1 ; port PL_KEY
BANK14_IO2: LED1.3(R) ; port PL_LED3
BANK14_IO3: HAT1.5(SCL.1)
BANK14_IO4: LED1.1(B) ; port PL_LED1
BANK14_IO5: LED1.4(G) ; port PL_LED2
BANK14_IO6: R24.2 ; port PL_BZ
BANK14_IO7: HAT1.3(SDA.1)
BANK14_IO8: HAT1.7(GPIO.7)
BANK14_IO9: HAT1.12(GPIO.1)
BANK14_IO10: HAT1.11(GPIO.0)
BANK14_IO11: HAT1.15(GPIO.3)
BANK14_IO12: HAT1.13(GPIO.2)
BANK14_IO13: HAT1.18(GPIO.5)
BANK14_IO14: HAT1.16(GPIO.4)
BANK14_IO15: HAT1.10(RXD)
BANK14_IO16: HAT1.21(MISO)
BANK14_IO17: HAT1.8(TXD)
BANK14_IO18: HAT1.19(MOSI)
BANK14_IO19: HAT1.27(SDA.0)
BANK14_IO20: HAT1.31(GPIO.22)
BANK14_IO21: HAT1.28(SCL.0)
BANK14_IO22: HAT1.24(CE0)
BANK14_IO23: HAT1.26(CE1)
BANK14_IO24: HAT1.23(SCLK)
BANK14_IO25: HAT1.22(GPIO.6)
BANK14_IO26: HAT1.33(GPIO.23)
BANK14_IO27: HAT1.29(GPIO.21)
BANK14_IO28: HAT1.37(GPIO.25)
BANK14_IO29: HAT1.36(GPIO.27)
BANK14_IO30: R50.2 ; port PMOD1.1
BANK14_IO32: R51.8 ; port PMOD1.8
BANK14_IO33: HAT1.40(GPIO.29)
BANK14_IO34: R51.6 ; port PMOD1.7
BANK14_IO35: HAT1.38(GPIO.28)
BANK14_IO36: HAT1.35(GPIO.24)
BANK14_IO37: HAT1.32(GPIO.26)
BANK14_IO38: R50.4 ; port PMOD1.2
BANK14_IO39: R50.6 ; port PMOD1.3
BANK14_IO40: R51.2 ; port PMOD1.5
BANK14_IO41: R51.4 ; port PMOD1.6
BANK14_IO42: R50.8 ; port PMOD1.4
BANK34_IO1: Shiel1.64 ; port Shiel-D2.12
BANK34_IO2: Shiel1.63 ; port Shiel-D2.11
BANK34_IO3: R47.2 ; port PMOD2.5
BANK34_IO4: R48.4 ; port PMOD3.2
BANK34_IO5: R48.2 ; port PMOD3.1
BANK34_IO6: R47.4 ; port PMOD2.6
BANK34_IO7: R48.8 ; port PMOD3.4
BANK34_IO8: R48.6 ; port PMOD3.3
BANK34_IO9: R49.2 ; port PMOD3.5
BANK34_IO10: R49.6 ; port PMOD3.7
BANK34_IO11: R49.4 ; port PMOD3.6
BANK34_IO12: R47.6 ; port PMOD2.7
BANK34_IO13: S3.2(A2) ; port PL_SW1
BANK34_IO14: R46.2 ; port PMOD2.1
BANK34_IO15: R49.8 ; port PMOD3.8
BANK34_IO16: R46.6 ; port PMOD2.3
BANK34_IO17: R46.4 ; port PMOD2.2
BANK34_IO18: R47.8 ; port PMOD2.8
BANK34_IO19: R46.8 ; port PMOD2.4
BANK34_IO20: S3.1(A1) ; port PL_SW2
BANK35_IO1: Shiel1.60 ; port Shiel-D2.8
BANK35_IO2: Shiel1.53 ; port Shiel-D2.1
BANK35_IO3: Shiel1.54 ; port Shiel-D2.2
BANK35_IO4: Shiel1.57 ; port Shiel-D2.5
BANK35_IO5: Shiel1.55 ; port Shiel-D2.3
BANK35_IO6: Shiel1.58 ; port Shiel-D2.6
BANK35_IO7: Shiel1.56 ; port Shiel-D2.4
BANK35_IO8: Shiel1.59 ; port Shiel-D2.7
BANK35_IO9: Shiel1.61 ; port Shiel-D2.9
BANK35_IO10: Shiel1.62 ; port Shiel-D2.10
CAN0_RX: Shiel1.44 ; port Shiel-C.16
CAN0_TX: Shiel1.42 ; port Shiel-C.15
FTM1_QDA: Shiel1.29 ; port Shiel-C.1
FTM1_QDB: Shiel1.30 ; port Shiel-C.9
FTM2_QDA: Shiel1.31 ; port Shiel-C.2
FTM2_QDB: Shiel1.32 ; port Shiel-C.10
LPTMR0: Shiel1.34 ; port Shiel-C.11
PTA5: Shiel1.33 ; port Shiel-C.3
PTA6: S6.1(A1) ; port PS_SW1
PTA7: S6.2(A2) ; port PS_SW2
PTA14: Shiel1.35 ; port Shiel-C.4
PTA15: Shiel1.36 ; port Shiel-C.12
PTA16: Shiel1.39 ; port Shiel-C.6
PTA17: Shiel1.38 ; port Shiel-C.13
PTA24: Shiel1.37 ; port Shiel-C.5
PTA25: Shiel1.40 ; port Shiel-C.14
PTA26: Shiel1.41 ; port Shiel-C.7
PTA27: Shiel1.43 ; port Shiel-C.8
PTA28: Shiel1.45 ; port Shiel-D1.1
PTA29: Shiel1.46 ; port Shiel-D1.5
PTB0: Shiel1.47 ; port Shiel-D1.2
PTB1: Shiel1.48 ; port Shiel-D1.6
PTB2: Shiel1.49 ; port Shiel-D1.3
PTB3: Shiel1.50 ; port Shiel-D1.7
PTB4: Shiel1.51 ; port Shiel-D1.4
PTB5: Shiel1.52 ; port Shiel-D1.8
PTD8: L6.1(A) ; port PS_LED1
PTD9: L5.1(A) ; port PS_LED2
PTE0: SD*1.8(DAT1)
PTE1: SD*1.7(DAT0)
PTE2: SD*1.5(CLK)
PTE3: SD*1.3(CMD)
PTE4: SD*1.2(DTA3)
PTE5: SD*1.1(DTA2)
PTE6: Shiel1.19 ; port Shiel-B.E6
PTE7: Shiel1.21 ; port Shiel-B.E7
PTE8: Shiel1.13 ; port Shiel-B.E8
PTE9: Shiel1.15 ; port Shiel-B.E9
PTE10: Shiel1.17 ; port Shiel-B.E10
PTE11: Shiel1.25 ; port Shiel-B.E11
PTE12: Shiel1.23 ; port Shiel-B.E12
PTE24: PMOD4.4 ; port PMOD4.1
PTE25: PMOD4.5 ; port PMOD4.2
PTE26: R52.2 ; port PS_BZ
PTE27: S4.1 ; port PS_KEY
PTE28: Shiel1.27 ; port Shiel-B.E28
RTC_WAKE: PMOD4.6 ; port PMOD4.3
USB0_N: R25.1 USB1.2(DM)
USB0_P: R26.1 USB1.3(DP)
USB0D_N: R25.2 ; port USB0D_N
USB0D_P: R26.2 ; port USB0D_P
NetD1_1: D1.1(A) LS1.2(B) Q1.1(C)
NetD2_1: D2.1(A) USB1.1(VBUS)
NetD11_1: D11.1(A) LS2.2(B) Q2.1(C)
NetL5_2: L5.2(K) R53.2
NetL6_2: L6.2(K) R54.2
NetLED1_2: LED1.2(+) R27.1
NetPMOD1_5: PMOD1.5 R51.1
NetPMOD1_6: PMOD1.6 R50.1
NetPMOD1_7: PMOD1.7 R51.3
NetPMOD1_8: PMOD1.8 R50.3
NetPMOD1_9: PMOD1.9 R51.5
NetPMOD1_10: PMOD1.10 R50.5
NetPMOD1_11: PMOD1.11 R51.7
NetPMOD1_12: PMOD1.12 R50.7
NetPMOD2_5: PMOD2.5 R47.1
NetPMOD2_6: PMOD2.6 R46.1
NetPMOD2_7: PMOD2.7 R47.3
NetPMOD2_8: PMOD2.8 R46.3
NetPMOD2_9: PMOD2.9 R47.5
NetPMOD2_10: PMOD2.10 R46.5
NetPMOD2_11: PMOD2.11 R47.7
NetPMOD2_12: PMOD2.12 R46.7
NetPMOD3_5: PMOD3.5 R49.1
NetPMOD3_6: PMOD3.6 R48.1
NetPMOD3_7: PMOD3.7 R49.3
NetPMOD3_8: PMOD3.8 R48.3
NetPMOD3_9: PMOD3.9 R49.5
NetPMOD3_10: PMOD3.10 R48.5
NetPMOD3_11: PMOD3.11 R49.7
NetPMOD3_12: PMOD3.12 R48.7
NetQ1_2: Q1.2(B) R24.1
NetQ2_2: Q2.2(B) R52.1
NetR28_2: R28.2 S2.2
NetR55_2: R55.2 S3.3(B2) S3.4(B1)
NetR56_2: R56.2 S6.3(B2) S6.4(B1)

Not connected (* = marked no-connect by the designer): SD*1 9(CD_SW)* 10* 11* 12* 13*; Shiel1 24*; USB1 0(Shield) 4(ID)

### Buses and harness runs
bus ANALOG[13..0]
bus BANK14_IO[42..1] = port BANK14_IO[42..1]
bus BANK15_IO[9..1] = port BANK15_IO[9..1]
bus PTE[5..0] = port PTE[5..0]

### Layout directives
differential pair: USB0_N, USB0_P, USB0D_N, USB0D_P

### Notes on the sheet
- (in symbol TF_card) SD_card

### Library data of the parts
C3 C63 C72 C73 = Cap: 贴片电容; Published: 8-Jun-2000; LatestRevisionDate: 17-Jul-2002; LatestRevisionNote: Re-released for DXP Platform.; PackageReference: RAD-0.3; Publisher: Altium Limited
D1 D2 D11 = Diode 1N4148: High Conductance Fast Diode; LatestRevisionDate: 17-Jul-2002; LatestRevisionNote: Re-released for DXP Platform.; DatasheetDocument: 1997; PackageReference: DO-35; Publisher: Altium Limited; Code_JEDEC: DO-204-AH; ComponentLink1Description: Manufacturer Link; ComponentLink2Description: Datasheet; ComponentLink2URL: http://www.fairchildsemi.com/ds/1N%2F1N4148.pdf
F1 = Fuse 1: Fuse; Published: 8-Jun-2000; LatestRevisionDate: 17-Jul-2002; LatestRevisionNote: Re-released for DXP Platform.; PackageReference: PIN-W2/E2.8; Publisher: Altium Limited; PackageDescription: Thru-Hole; 2 Leads
LS1 LS2 = Bell: Electrical Bell; Published: 24-Mar-1999; LatestRevisionDate: 17-Jul-2002; LatestRevisionNote: Re-released for DXP Platform.; PackageReference: PIN2; Publisher: Altium Limited
PMOD1-PMOD3 = Header 6X2: Header, 6-Pin, Dual row; LatestRevisionDate: 17-Jul-2002; LatestRevisionNote: Re-released for DXP Platform.; Publisher: Altium Limited
PMOD4 = Header 6: Header, 6-Pin; LatestRevisionDate: 17-Jul-2002; LatestRevisionNote: Re-released for DXP Platform.; Publisher: Altium Limited
Q1 Q2 = QNPN: NPN Bipolar Transistor; pin to pad: 2>3 3>2; Published: 8-Jun-2000; LatestRevisionDate: 29-May-2009; LatestRevisionNote: IPC-7351 Footprint Added.; PackageVersion: Aug-1999; PackageReference: SOT-23B; Publisher: Altium Limited; PackageDescription: 3-Pin SOT-23 Package 0.95 mm Pitch, 2.4 mm Lead Span
R24 R52 = Res2: Resistor; Published: 8-Jun-2000; LatestRevisionDate: 17-Jul-2002; LatestRevisionNote: Re-released for DXP Platform.; PackageReference: AXIAL-0.4; Publisher: Altium Limited; PackageDescription: Axial Device, Thru-Hole; 2 Leads; 0.4 in Pin Spacing
R25-R28 R53-R56 = Res: 贴片电阻; Published: 8-Jun-2000; LatestRevisionDate: 17-Jul-2002; LatestRevisionNote: Re-released for DXP Platform.; PackageReference: AXIAL-0.3; Publisher: Altium Limited
S2 S4 = SW-PB: Switch
  S2: Published: 24-Mar-1999; LatestRevisionDate: 17-Jul-2002; LatestRevisionNote: Re-released for DXP Platform.; PackageReference: SPST-2; Publisher: Altium Limited; PackageDescription: Switch; 2 Leads
S3 S6 = SW DIP-2: DIP Switch, 2 Position, SPST; Published: 24-Mar-1999; LatestRevisionDate: 17-Jul-2002; LatestRevisionNote: Re-released for DXP Platform.; PackageReference: DIP-4; Publisher: Altium Limited

## Sheet MEMORY.SchDoc
size A4
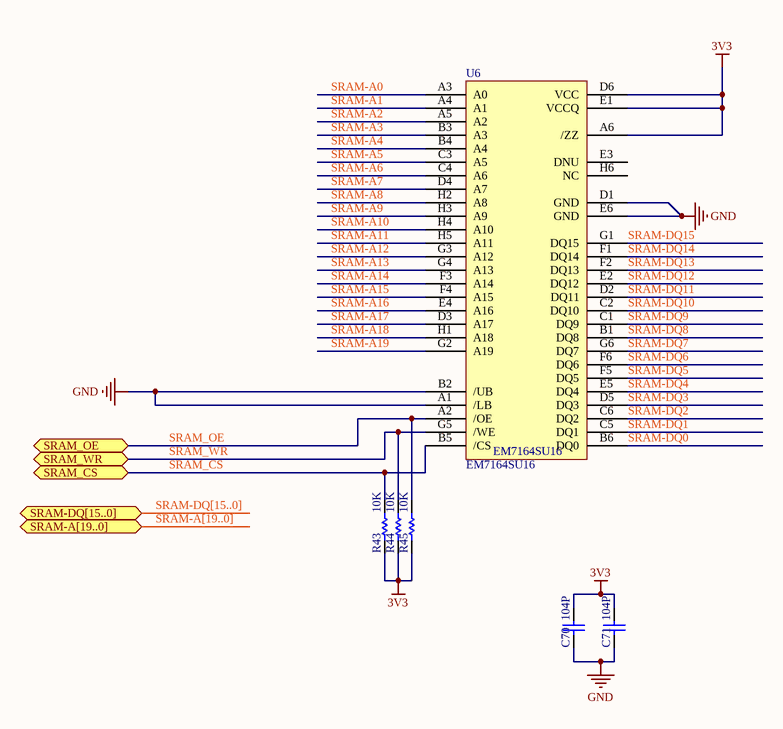
[diagram p4: MEMORY.SchDoc]

### Parts
C70  value 104P  [1608[0603]]  (hidden comment: Cap)
C71  value 104P  [1608[0603]]  (hidden comment: Cap)
R43  value 10K  [1608[0603]]  (hidden comment: Res)
R44  value 10K  [1608[0603]]  (hidden comment: Res)
R45  value 10K  [1608[0603]]  (hidden comment: Res)
U6  EM7164SU16  [BGA48C75P6X8_598X698X104]

### Ports
SRAM-A[19..0], SRAM-DQ[15..0], SRAM_CS, SRAM_OE, SRAM_WR

### Nets
3V3: C70.2 C71.2 R43.2 R44.2 R45.2 U6.A6(/ZZ) U6.D6(VCC) U6.E1(VCCQ)
GND: C70.1 C71.1 U6.A1(/LB) U6.B2(/UB) U6.D1(GND) U6.E6(GND)
SRAM-A0: U6.A3(A0)
SRAM-A1: U6.A4(A1)
SRAM-A2: U6.A5(A2)
SRAM-A3: U6.B3(A3)
SRAM-A4: U6.B4(A4)
SRAM-A5: U6.C3(A5)
SRAM-A6: U6.C4(A6)
SRAM-A7: U6.D4(A7)
SRAM-A8: U6.H2(A8)
SRAM-A9: U6.H3(A9)
SRAM-A10: U6.H4(A10)
SRAM-A11: U6.H5(A11)
SRAM-A12: U6.G3(A12)
SRAM-A13: U6.G4(A13)
SRAM-A14: U6.F3(A14)
SRAM-A15: U6.F4(A15)
SRAM-A16: U6.E4(A16)
SRAM-A17: U6.D3(A17)
SRAM-A18: U6.H1(A18)
SRAM-A19: U6.G2(A19)
SRAM-DQ0: U6.B6(DQ0)
SRAM-DQ1: U6.C5(DQ1)
SRAM-DQ2: U6.C6(DQ2)
SRAM-DQ3: U6.D5(DQ3)
SRAM-DQ4: U6.E5(DQ4)
SRAM-DQ5: U6.F5(DQ5)
SRAM-DQ6: U6.F6(DQ6)
SRAM-DQ7: U6.G6(DQ7)
SRAM-DQ8: U6.B1(DQ8)
SRAM-DQ9: U6.C1(DQ9)
SRAM-DQ10: U6.C2(DQ10)
SRAM-DQ11: U6.D2(DQ11)
SRAM-DQ12: U6.E2(DQ12)
SRAM-DQ13: U6.F2(DQ13)
SRAM-DQ14: U6.F1(DQ14)
SRAM-DQ15: U6.G1(DQ15)
SRAM_CS: R43.1 U6.B5(/CS) ; port SRAM_CS
SRAM_OE: R45.1 U6.A2(/OE) ; port SRAM_OE
SRAM_WR: R44.1 U6.G5(/WE) ; port SRAM_WR

Not connected (* = marked no-connect by the designer): U6 E3(DNU) H6(NC)

### Buses and harness runs
bus SRAM-A[19..0] = port SRAM-A[19..0]
bus SRAM-DQ[15..0] = port SRAM-DQ[15..0]

### Library data of the parts
C70 C71 = Cap: 贴片电容; Published: 8-Jun-2000; LatestRevisionDate: 17-Jul-2002; LatestRevisionNote: Re-released for DXP Platform.; PackageReference: RAD-0.3; Publisher: Altium Limited
R43-R45 = Res: 贴片电阻; Published: 8-Jun-2000; LatestRevisionDate: 17-Jul-2002; LatestRevisionNote: Re-released for DXP Platform.; PackageReference: AXIAL-0.3; Publisher: Altium Limited

## Sheet FPGA_CONFIG.SchDoc
size A4
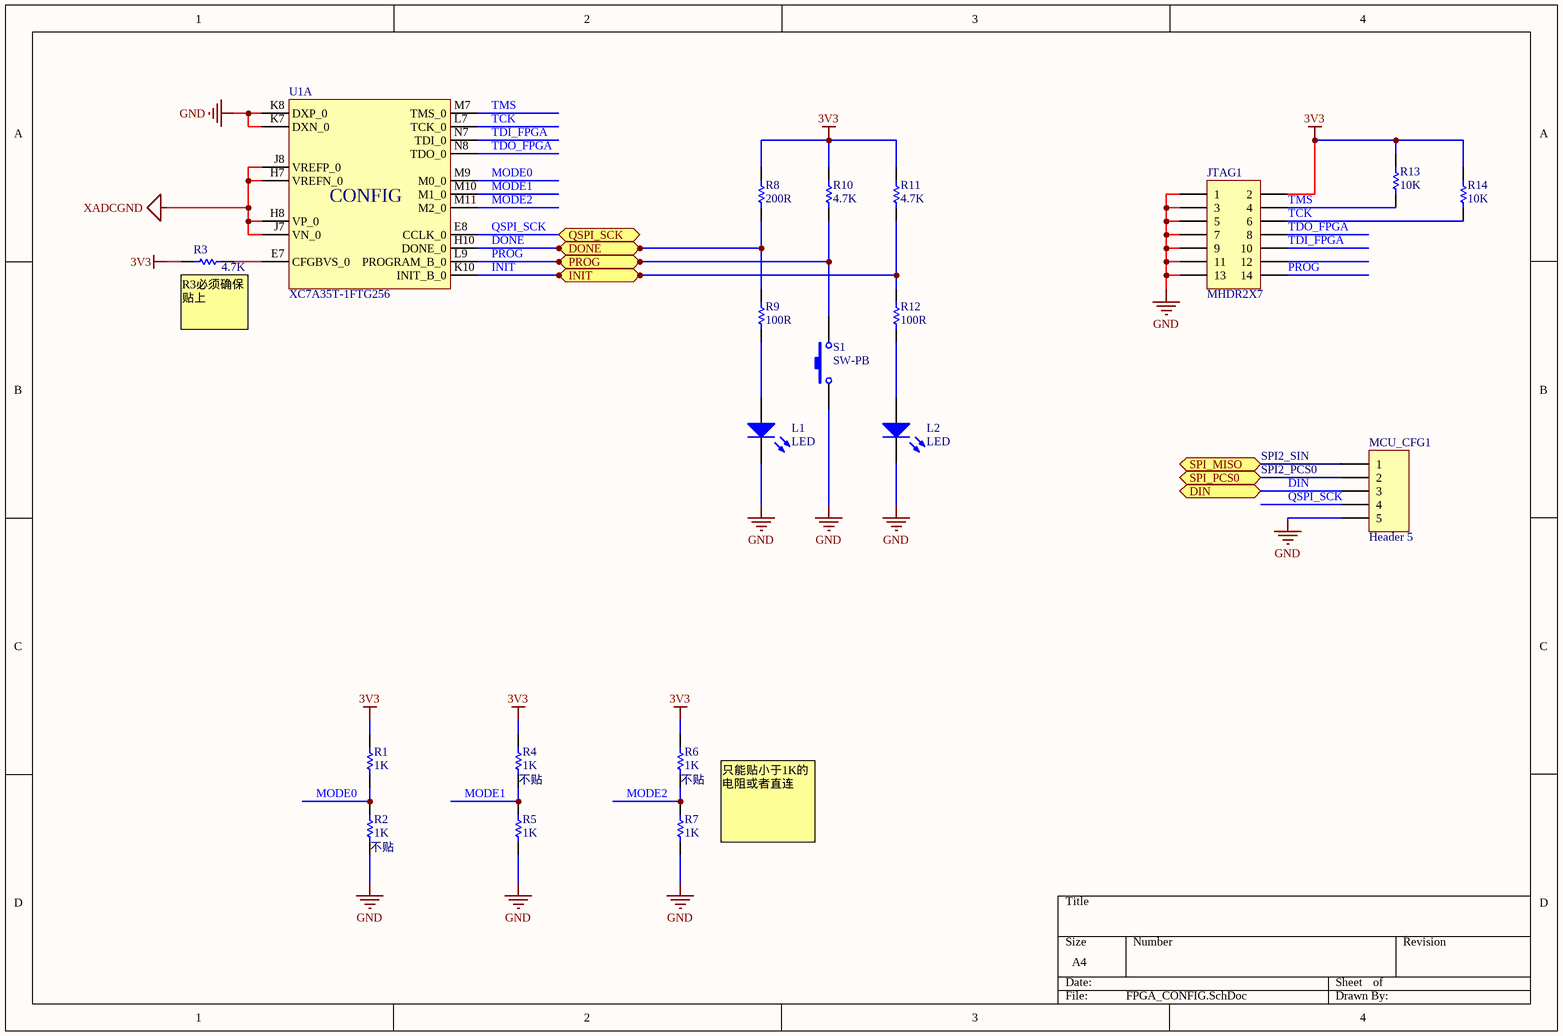
[diagram p5: FPGA_CONFIG.SchDoc]

### Parts
JTAG1  MHDR2X7  [Hearder2 7X2]
L1  LED  [1608[0603]]
L2  LED  [1608[0603]]
MCU_CFG1  Header 5  [MHDR1X5]
R1  value 1K  [1608[0603]]  (hidden comment: Res)
R2  不贴  value 1K  [1608[0603]]
R3  value 4.7K  [0402]  (hidden comment: Res)
R4  不贴  value 1K  [1608[0603]]
R5  value 1K  [1608[0603]]  (hidden comment: Res)
R6  不贴  value 1K  [1608[0603]]
R7  value 1K  [1608[0603]]  (hidden comment: Res)
R8  value 200R  [1608[0603]]  (hidden comment: Res)
R9  value 100R  [1608[0603]]  (hidden comment: Res)
R10  value 4.7K  [1608[0603]]  (hidden comment: Res)
R11  value 4.7K  [1608[0603]]  (hidden comment: Res)
R12  value 100R  [1608[0603]]  (hidden comment: Res)
R13  value 10K  [1608[0603]]  (hidden comment: Res)
R14  value 10K  [1608[0603]]  (hidden comment: Res)
S1  SW-PB  [key 3*4*2]
U1  XC7A35T-1FTG256  [BGA100P9X9-81A]  (part A of 7)

### Ports
DIN, DONE, INIT, PROG, QSPI_SCK, SPI_MISO, SPI_PCS0

### Nets
3V3: JTAG1.2 R1.2 R3.1 R4.2 R6.2 R8.2 R10.2 R11.2 R13.2 R14.2
GND: JTAG1.1 JTAG1.3 JTAG1.5 JTAG1.7 JTAG1.9 JTAG1.11 JTAG1.13 L1.2(K) L2.2(K) MCU_CFG1.5 R2.1 R5.1 R7.1 S1.1 U1.K7(DXN_0) U1.K8(DXP_0)
XADCGND: U1.H7(VREFN_0) U1.H8(VP_0) U1.J7(VN_0) U1.J8(VREFP_0)
DIN: MCU_CFG1.3 ; port DIN
DONE: R8.1 R9.2 U1.H10(DONE_0) ; port DONE
INIT: R11.1 R12.2 U1.K10(INIT_B_0) ; port INIT
MODE0: R1.1 R2.2 U1.M9(M0_0)
MODE1: R4.1 R5.2 U1.M10(M1_0)
MODE2: R6.1 R7.2 U1.M11(M2_0)
PROG: JTAG1.14 R10.1 S1.2 U1.L9(PROGRAM_B_0) ; port PROG
QSPI_SCK: MCU_CFG1.4 U1.E8(CCLK_0) ; port QSPI_SCK
SPI2_PCS0: MCU_CFG1.2 ; port SPI_PCS0
SPI2_SIN: MCU_CFG1.1 ; port SPI_MISO
TCK: JTAG1.6 R14.1 U1.L7(TCK_0)
TDI_FPGA: JTAG1.10 U1.N7(TDI_0)
TDO_FPGA: JTAG1.8 U1.N8(TDO_0)
TMS: JTAG1.4 R13.1 U1.M7(TMS_0)
NetL1_1: L1.1(A) R9.1
NetL2_1: L2.1(A) R12.1
NetR3_2: R3.2 U1.E7(CFGBVS_0)

Not connected (* = marked no-connect by the designer): JTAG1 12

### Notes on the sheet
- (near R3) R3必须确保贴上
- 只能贴小于1K的电阻或者直连
- (in symbol XC7A35T-1FTG256, part A) CONFIG

### Library data of the parts
JTAG1 = MHDR2X7: Header, 7-Pin, Dual row; LatestRevisionDate: 17-Jul-2002; LatestRevisionNote: Re-released for DXP Platform.; Publisher: Altium Limited
MCU_CFG1 = Header 5: Header, 5-Pin; LatestRevisionDate: 17-Jul-2002; LatestRevisionNote: Re-released for DXP Platform.; Publisher: Altium Limited
R1-R14 = Res: 贴片电阻; Published: 8-Jun-2000; LatestRevisionDate: 17-Jul-2002; LatestRevisionNote: Re-released for DXP Platform.; PackageReference: AXIAL-0.3; Publisher: Altium Limited
S1 = SW-PB: Switch; Published: 24-Mar-1999; LatestRevisionDate: 17-Jul-2002; LatestRevisionNote: Re-released for DXP Platform.; PackageReference: SPST-2; Publisher: Altium Limited; PackageDescription: Switch; 2 Leads

## Sheet FPGA_POWER.SchDoc
size A4
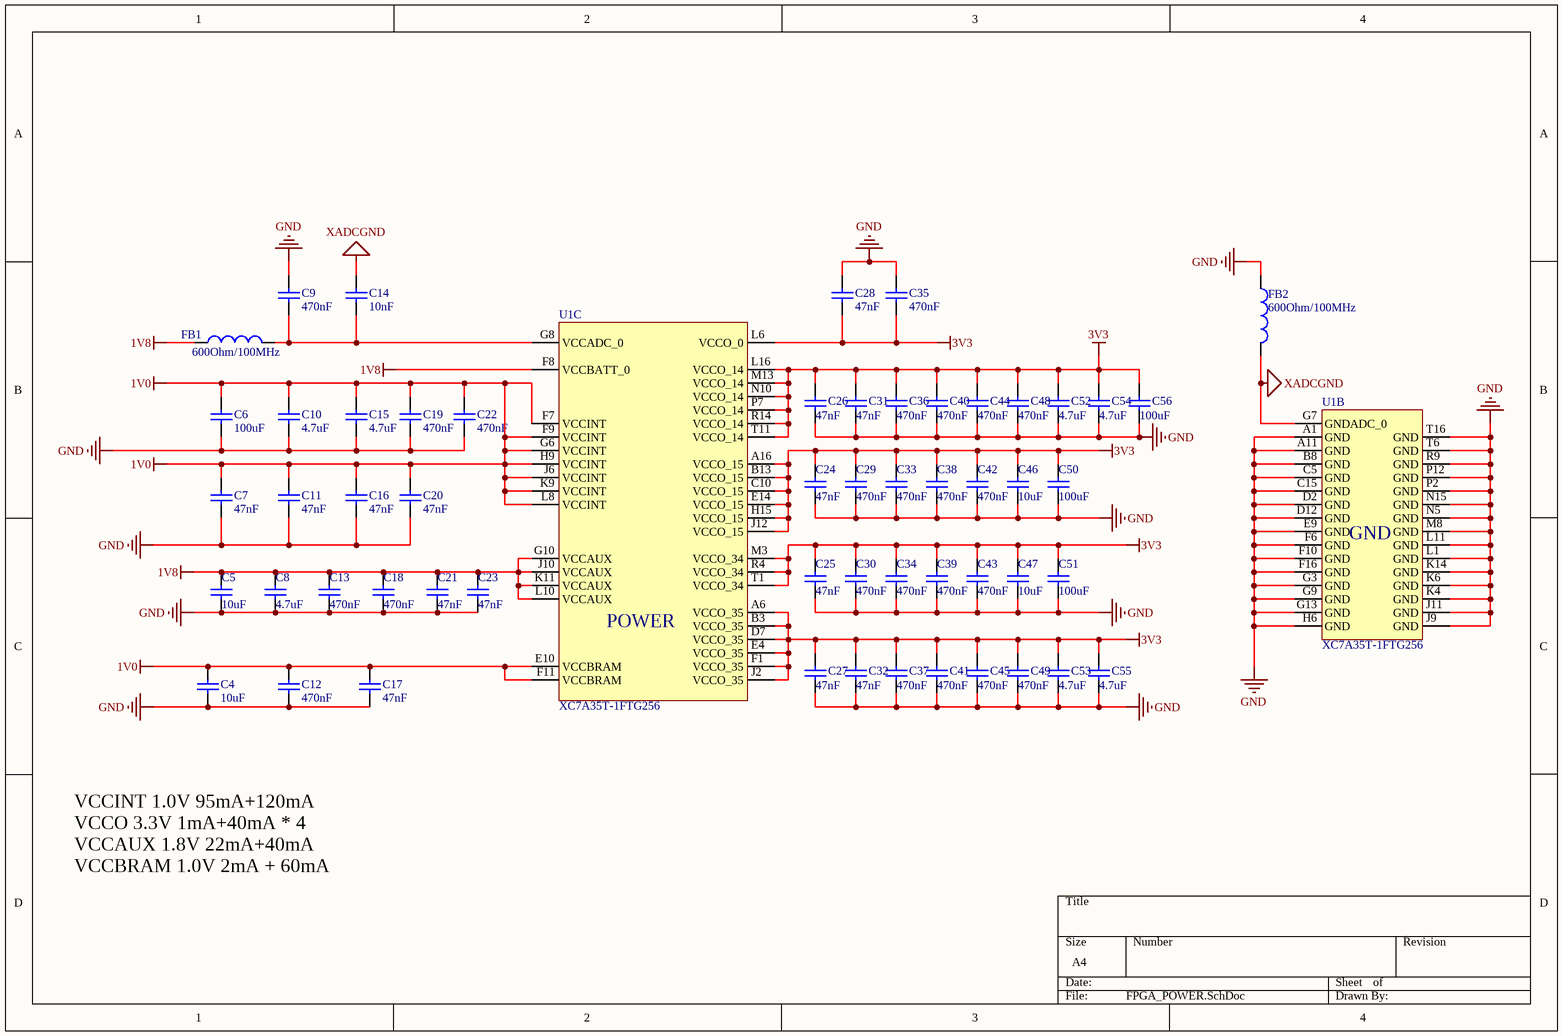
[diagram p6: FPGA_POWER.SchDoc]

### Parts
C4  value 10uF  [0402]  (hidden comment: Cap)
C5  value 10uF  [0402]  (hidden comment: Cap)
C6  value 100uF  [2512]  (hidden comment: Cap)
C7  value 47nF  [0402]  (hidden comment: Cap)
C8  value 4.7uF  [0402]  (hidden comment: Cap)
C9  value 470nF  [0402]  (hidden comment: Cap)
C10  value 4.7uF  [0402]  (hidden comment: Cap)
C11  value 47nF  [0402]  (hidden comment: Cap)
C12  value 470nF  [0402]  (hidden comment: Cap)
C13  value 470nF  [0402]  (hidden comment: Cap)
C14  value 10nF  [0402]  (hidden comment: Cap)
C15  value 4.7uF  [0402]  (hidden comment: Cap)
C16  value 47nF  [0402]  (hidden comment: Cap)
C17  value 47nF  [0402]  (hidden comment: Cap)
C18  value 470nF  [0402]  (hidden comment: Cap)
C19  value 470nF  [0402]  (hidden comment: Cap)
C20  value 47nF  [0402]  (hidden comment: Cap)
C21  value 47nF  [0402]  (hidden comment: Cap)
C22  value 470nF  [0402]  (hidden comment: Cap)
C23  value 47nF  [0402]  (hidden comment: Cap)
C24  value 47nF  [0402]  (hidden comment: Cap)
C25  value 47nF  [0402]  (hidden comment: Cap)
C26  value 47nF  [0402]  (hidden comment: Cap)
C27  value 47nF  [0402]  (hidden comment: Cap)
C28  value 47nF  [0402]  (hidden comment: Cap)
C29  value 470nF  [0402]  (hidden comment: Cap)
C30  value 470nF  [0402]  (hidden comment: Cap)
C31  value 47nF  [0402]  (hidden comment: Cap)
C32  value 47nF  [0402]  (hidden comment: Cap)
C33  value 470nF  [0402]  (hidden comment: Cap)
C34  value 470nF  [0402]  (hidden comment: Cap)
C35  value 470nF  [0402]  (hidden comment: Cap)
C36  value 470nF  [0402]  (hidden comment: Cap)
C37  value 470nF  [0402]  (hidden comment: Cap)
C38  value 470nF  [0402]  (hidden comment: Cap)
C39  value 470nF  [0402]  (hidden comment: Cap)
C40  value 470nF  [0402]  (hidden comment: Cap)
C41  value 470nF  [0402]  (hidden comment: Cap)
C42  value 470nF  [0402]  (hidden comment: Cap)
C43  value 470nF  [0402]  (hidden comment: Cap)
C44  value 470nF  [0402]  (hidden comment: Cap)
C45  value 470nF  [0402]  (hidden comment: Cap)
C46  value 10uF  [0402]  (hidden comment: Cap)
C47  value 10uF  [0402]  (hidden comment: Cap)
C48  value 470nF  [0402]  (hidden comment: Cap)
C49  value 470nF  [0402]  (hidden comment: Cap)
C50  value 100uF  [2512]  (hidden comment: Cap)
C51  value 100uF  [2512]  (hidden comment: Cap)
C52  value 4.7uF  [0402]  (hidden comment: Cap)
C53  value 4.7uF  [0402]  (hidden comment: Cap)
C54  value 4.7uF  [0402]  (hidden comment: Cap)
C55  value 4.7uF  [0402]  (hidden comment: Cap)
C56  value 100uF  [2512]  (hidden comment: Cap)
FB1  value 600Ohm/100MHz  [0402]  (hidden comment: Inductor)
FB2  value 600Ohm/100MHz  [0402]  (hidden comment: Inductor)
U1  XC7A35T-1FTG256  [BGA100P9X9-81A]  (parts B,C of 7)

### Nets
1V0: C4.1 C6.1 C7.1 C10.1 C11.1 C12.1 C15.1 C16.1 C17.1 C19.1 C20.1 C22.1 U1.E10(VCCBRAM) U1.F7(VCCINT) U1.F9(VCCINT) U1.F11(VCCBRAM) U1.G6(VCCINT) U1.H9(VCCINT) U1.J6(VCCINT) U1.K9(VCCINT) U1.L8(VCCINT)
1V8: C5.1 C8.1 C13.1 C18.1 C21.1 C23.1 FB1.1 U1.F8(VCCBATT_0) U1.G10(VCCAUX) U1.J10(VCCAUX) U1.K11(VCCAUX) U1.L10(VCCAUX)
3V3: C24.1 C25.1 C26.1 C27.1 C28.2 C29.1 C30.1 C31.1 C32.1 C33.1 C34.1 C35.2 C36.1 C37.1 C38.1 C39.1 C40.1 C41.1 C42.1 C43.1 C44.1 C45.1 C46.1 C47.1 C48.1 C49.1 C50.1 C51.1 C52.1 C53.1 C54.1 C55.1 C56.1 U1.A6(VCCO_35) U1.A16(VCCO_15) U1.B3(VCCO_35) U1.B13(VCCO_15) U1.C10(VCCO_15) U1.D7(VCCO_35) U1.E4(VCCO_35) U1.E14(VCCO_15) U1.F1(VCCO_35) U1.H15(VCCO_15) U1.J2(VCCO_35) U1.J12(VCCO_15) U1.L6(VCCO_0) U1.L16(VCCO_14) U1.M3(VCCO_34) U1.M13(VCCO_14) U1.N10(VCCO_14) U1.P7(VCCO_14) U1.R4(VCCO_34) U1.R14(VCCO_14) U1.T1(VCCO_34) U1.T11(VCCO_14)
GND: C4.2 C5.2 C6.2 C7.2 C8.2 C9.1 C10.2 C11.2 C12.2 C13.2 C15.2 C16.2 C17.2 C18.2 C19.2 C20.2 C21.2 C22.2 C23.2 C24.2 C25.2 C26.2 C27.2 C28.1 C29.2 C30.2 C31.2 C32.2 C33.2 C34.2 C35.1 C36.2 C37.2 C38.2 C39.2 C40.2 C41.2 C42.2 C43.2 C44.2 C45.2 C46.2 C47.2 C48.2 C49.2 C50.2 C51.2 C52.2 C53.2 C54.2 C55.2 C56.2 FB2.1 U1.A1(GND) U1.A11(GND) U1.B8(GND) U1.C5(GND) U1.C15(GND) U1.D2(GND) U1.D12(GND) U1.E9(GND) U1.F6(GND) U1.F10(GND) U1.F16(GND) U1.G3(GND) U1.G9(GND) U1.G13(GND) U1.H6(GND) U1.J9(GND) U1.J11(GND) U1.K4(GND) U1.K6(GND) U1.K14(GND) U1.L1(GND) U1.L11(GND) U1.M8(GND) U1.N5(GND) U1.N15(GND) U1.P2(GND) U1.P12(GND) U1.R9(GND) U1.T6(GND) U1.T16(GND)
XADCGND: C14.2 FB2.2 U1.G7(GNDADC_0)
NetC9_2: C9.2 C14.1 FB1.2 U1.G8(VCCADC_0)

### Notes on the sheet
- VCCINT 1.0V 95mA+120mA
  VCCO 3.3V 1mA+40mA * 4
  VCCAUX 1.8V 22mA+40mA
  VCCBRAM 1.0V 2mA + 60mA
- (in symbol XC7A35T-1FTG256, part C) POWER

### Library data of the parts
C4-C56 = Cap: 贴片电容; Published: 8-Jun-2000; LatestRevisionDate: 17-Jul-2002; LatestRevisionNote: Re-released for DXP Platform.; PackageReference: RAD-0.3; Publisher: Altium Limited
FB1 FB2 = Inductor: Code_IEC: 1005; Published: 8-Jun-2000; LatestRevisionDate: 29-May-2009; LatestRevisionNote: IPC-7351 Footprint Added.; PackageReference: 0402-A; Publisher: Altium Limited; PackageDescription: Chip Inductor; Code_JEITA: 0402

## Nets that join several sheets
1V0: POWER (F2.1), FPGA_POWER (21 pins)
1V8: POWER (F4.1), FPGA_POWER (12 pins)
3V3: FPGA_IO (9 pins), POWER (F3.1), GENERAL-IO (21 pins), MEMORY (8 pins), FPGA_CONFIG (10 pins), FPGA_POWER (55 pins)
5V0: POWER (15 pins), GENERAL-IO (F1.1)
GND: FPGA_IO (6 pins), POWER (11 pins), GENERAL-IO (32 pins), MEMORY (6 pins), FPGA_CONFIG (16 pins), FPGA_POWER (83 pins)
XADCGND: FPGA_CONFIG (U1.H7 U1.H8 U1.J7 U1.J8), FPGA_POWER (C14.2 FB2.2 U1.G7)
BANK14_IO1: FPGA_IO (U1.K12), GENERAL-IO (S2.1)
BANK14_IO2: FPGA_IO (U1.L14), GENERAL-IO (LED1.3)
BANK14_IO3: FPGA_IO (U1.M14), GENERAL-IO (HAT1.5)
BANK14_IO4: FPGA_IO (U1.K13), GENERAL-IO (LED1.1)
BANK14_IO5: FPGA_IO (U1.L13), GENERAL-IO (LED1.4)
BANK14_IO6: FPGA_IO (U1.M12), GENERAL-IO (R24.2)
BANK14_IO7: FPGA_IO (U1.M16), GENERAL-IO (HAT1.3)
BANK14_IO8: FPGA_IO (U1.N16), GENERAL-IO (HAT1.7)
BANK14_IO9: FPGA_IO (U1.P15), GENERAL-IO (HAT1.12)
BANK14_IO10: FPGA_IO (U1.P16), GENERAL-IO (HAT1.11)
BANK14_IO11: FPGA_IO (U1.R15), GENERAL-IO (HAT1.15)
BANK14_IO12: FPGA_IO (U1.R16), GENERAL-IO (HAT1.13)
BANK14_IO13: FPGA_IO (U1.T14), GENERAL-IO (HAT1.18)
BANK14_IO14: FPGA_IO (U1.T15), GENERAL-IO (HAT1.16)
BANK14_IO15: FPGA_IO (U1.N13), GENERAL-IO (HAT1.10)
BANK14_IO16: FPGA_IO (U1.P13), GENERAL-IO (HAT1.21)
BANK14_IO17: FPGA_IO (U1.N14), GENERAL-IO (HAT1.8)
BANK14_IO18: FPGA_IO (U1.P14), GENERAL-IO (HAT1.19)
BANK14_IO19: FPGA_IO (U1.N12), GENERAL-IO (HAT1.27)
BANK14_IO20: FPGA_IO (U1.P10), GENERAL-IO (HAT1.31)
BANK14_IO21: FPGA_IO (U1.P11), GENERAL-IO (HAT1.28)
BANK14_IO22: FPGA_IO (U1.R12), GENERAL-IO (HAT1.24)
BANK14_IO23: FPGA_IO (U1.T12), GENERAL-IO (HAT1.26)
BANK14_IO24: FPGA_IO (U1.R13), GENERAL-IO (HAT1.23)
BANK14_IO25: FPGA_IO (U1.T13), GENERAL-IO (HAT1.22)
BANK14_IO26: FPGA_IO (U1.R10), GENERAL-IO (HAT1.33)
BANK14_IO27: FPGA_IO (U1.R11), GENERAL-IO (HAT1.29)
BANK14_IO28: FPGA_IO (U1.N9), GENERAL-IO (HAT1.37)
BANK14_IO29: FPGA_IO (U1.P9), GENERAL-IO (HAT1.36)
BANK14_IO30: FPGA_IO (U1.M6), GENERAL-IO (R50.2)
BANK14_IO32: FPGA_IO (U1.P8), GENERAL-IO (R51.8)
BANK14_IO33: FPGA_IO (U1.R8), GENERAL-IO (HAT1.40)
BANK14_IO34: FPGA_IO (U1.T7), GENERAL-IO (R51.6)
BANK14_IO35: FPGA_IO (U1.T8), GENERAL-IO (HAT1.38)
BANK14_IO36: FPGA_IO (U1.T9), GENERAL-IO (HAT1.35)
BANK14_IO37: FPGA_IO (U1.T10), GENERAL-IO (HAT1.32)
BANK14_IO38: FPGA_IO (U1.R5), GENERAL-IO (R50.4)
BANK14_IO39: FPGA_IO (U1.T5), GENERAL-IO (R50.6)
BANK14_IO40: FPGA_IO (U1.R6), GENERAL-IO (R51.2)
BANK14_IO41: FPGA_IO (U1.R7), GENERAL-IO (R51.4)
BANK14_IO42: FPGA_IO (U1.P6), GENERAL-IO (R50.8)
BANK34_IO1: FPGA_IO (U1.L5), GENERAL-IO (Shiel1.64)
BANK34_IO2: FPGA_IO (U1.L4), GENERAL-IO (Shiel1.63)
BANK34_IO3: FPGA_IO (U1.M4), GENERAL-IO (R47.2)
BANK34_IO4: FPGA_IO (U1.M2), GENERAL-IO (R48.4)
BANK34_IO5: FPGA_IO (U1.M1), GENERAL-IO (R48.2)
BANK34_IO6: FPGA_IO (U1.N3), GENERAL-IO (R47.4)
BANK34_IO7: FPGA_IO (U1.N2), GENERAL-IO (R48.8)
BANK34_IO8: FPGA_IO (U1.N1), GENERAL-IO (R48.6)
BANK34_IO9: FPGA_IO (U1.P1), GENERAL-IO (R49.2)
BANK34_IO10: FPGA_IO (U1.P4), GENERAL-IO (R49.6)
BANK34_IO11: FPGA_IO (U1.P3), GENERAL-IO (R49.4)
BANK34_IO12: FPGA_IO (U1.M5), GENERAL-IO (R47.6)
BANK34_IO13: FPGA_IO (U1.N4), GENERAL-IO (S3.2)
BANK34_IO14: FPGA_IO (U1.R2), GENERAL-IO (R46.2)
BANK34_IO15: FPGA_IO (U1.R1), GENERAL-IO (R49.8)
BANK34_IO16: FPGA_IO (U1.R3), GENERAL-IO (R46.6)
BANK34_IO17: FPGA_IO (U1.T2), GENERAL-IO (R46.4)
BANK34_IO18: FPGA_IO (U1.T4), GENERAL-IO (R47.8)
BANK34_IO19: FPGA_IO (U1.T3), GENERAL-IO (R46.8)
BANK34_IO20: FPGA_IO (U1.P5), GENERAL-IO (S3.1)
BANK35_IO1: FPGA_IO (U1.E6), GENERAL-IO (Shiel1.60)
BANK35_IO2: FPGA_IO (U1.B7), GENERAL-IO (Shiel1.53)
BANK35_IO3: FPGA_IO (U1.A7), GENERAL-IO (Shiel1.54)
BANK35_IO4: FPGA_IO (U1.B6), GENERAL-IO (Shiel1.57)
BANK35_IO5: FPGA_IO (U1.C7), GENERAL-IO (Shiel1.55)
BANK35_IO6: FPGA_IO (U1.C6), GENERAL-IO (Shiel1.58)
BANK35_IO7: FPGA_IO (U1.D6), GENERAL-IO (Shiel1.56)
BANK35_IO8: FPGA_IO (U1.D5), GENERAL-IO (Shiel1.59)
BANK35_IO9: FPGA_IO (U1.F5), GENERAL-IO (Shiel1.61)
BANK35_IO10: FPGA_IO (U1.K5), GENERAL-IO (Shiel1.62)
DIN: FPGA_IO (R16.2 U1.J14), FPGA_CONFIG (MCU_CFG1.3)
QSPI_SCK: FPGA_IO (R20.1 U2.6), FPGA_CONFIG (MCU_CFG1.4 U1.E8)
SRAM_CS: FPGA_IO (U1.J3), MEMORY (R43.1 U6.B5)
SRAM_OE: FPGA_IO (U1.G4), MEMORY (R45.1 U6.A2)
SRAM_WR: FPGA_IO (U1.C4), MEMORY (R44.1 U6.G5)